# EAGLE schematic dsp_board_power_amplifier (EAGLE 9.6.2)
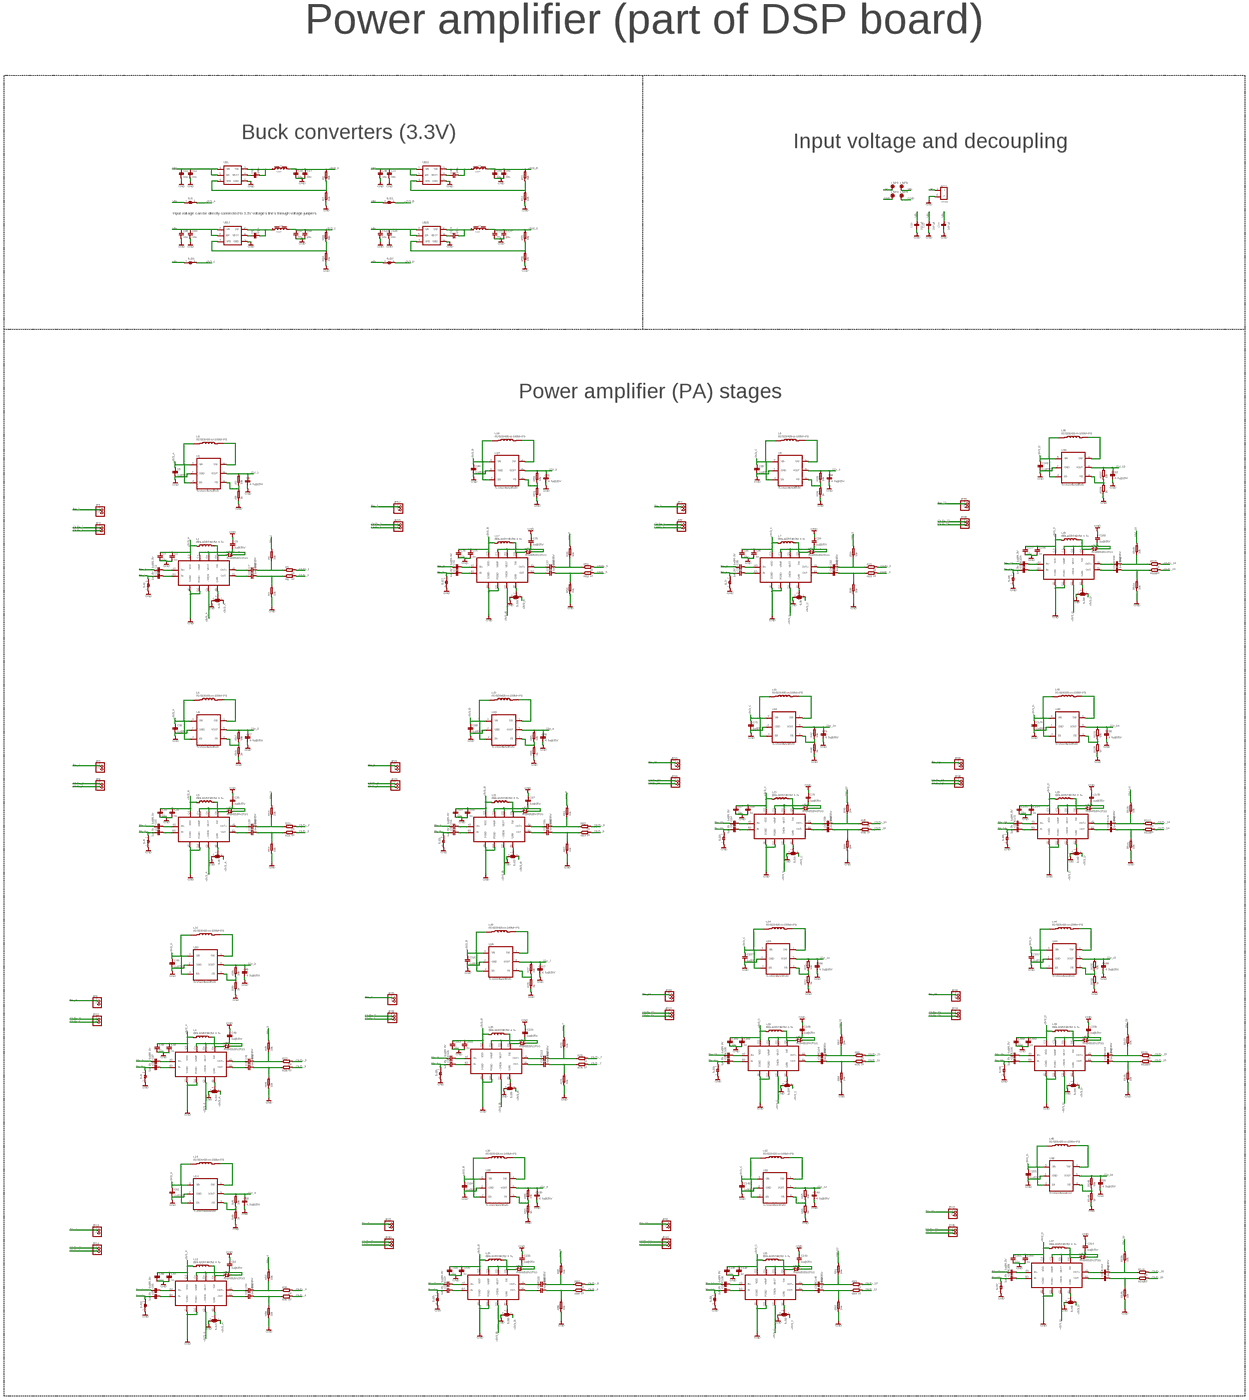
[diagram p0: schematic, sheet 1, overview]
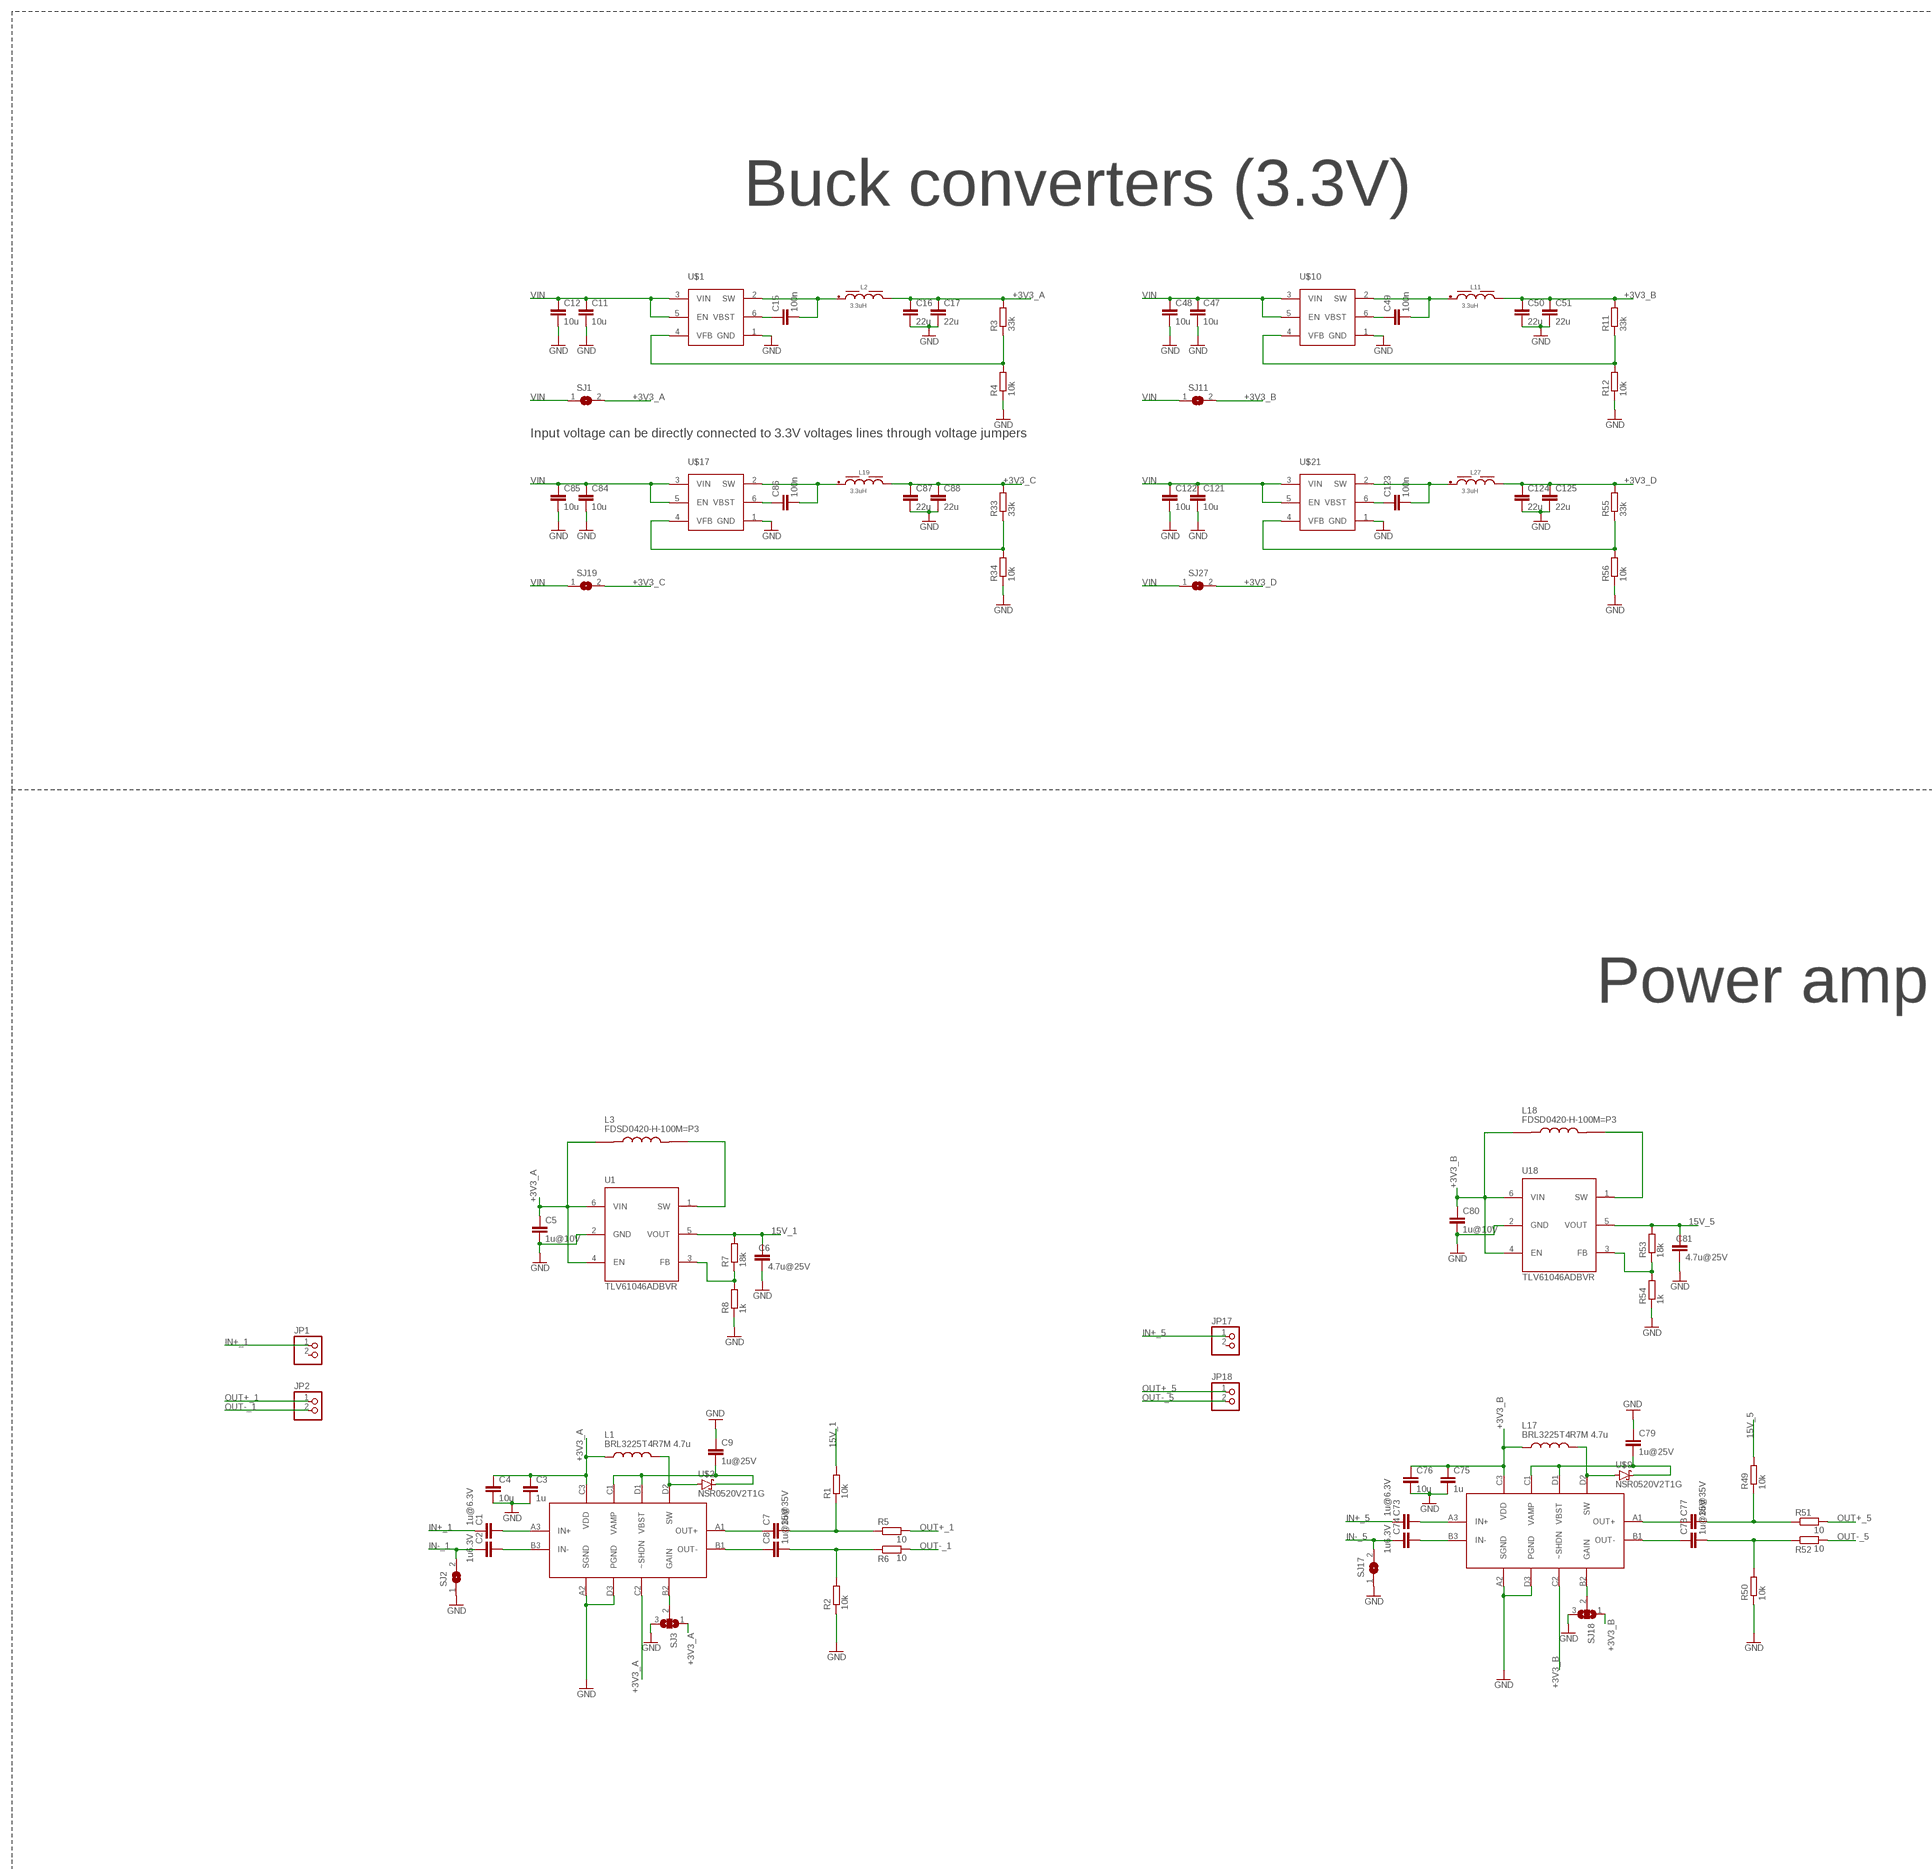
[diagram p1: schematic, sheet 1, part 1 of 6]
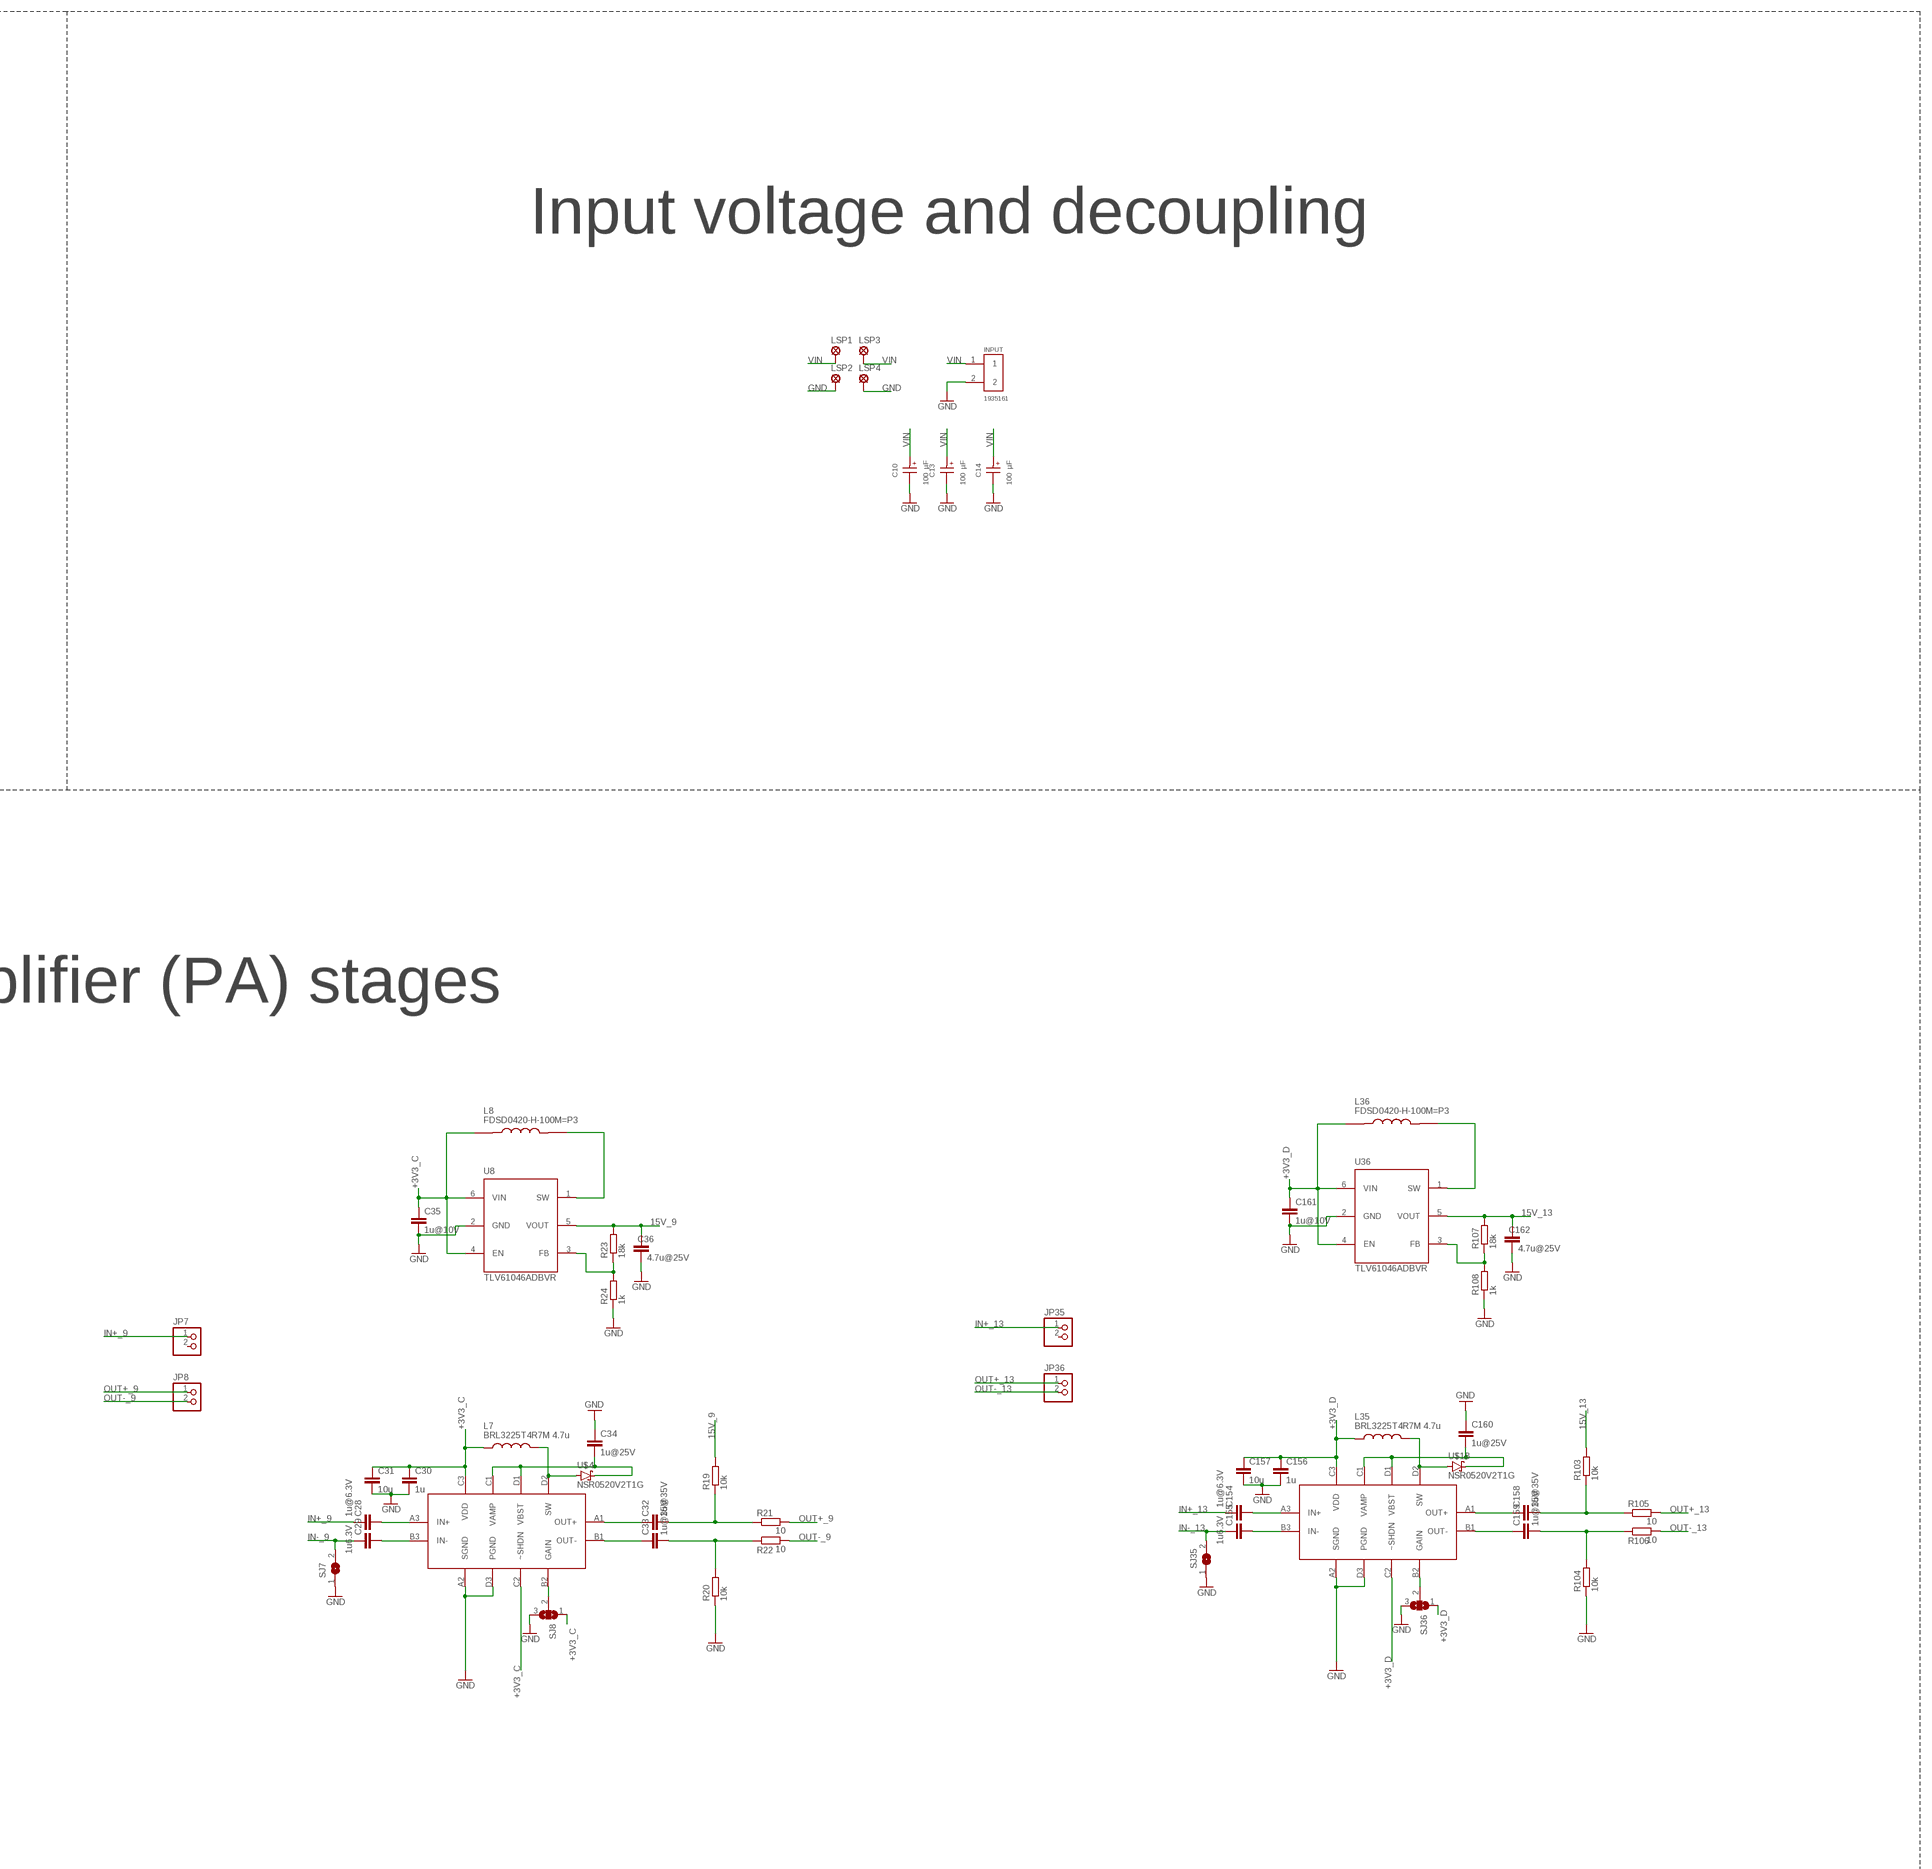
[diagram p2: schematic, sheet 1, part 2 of 6]
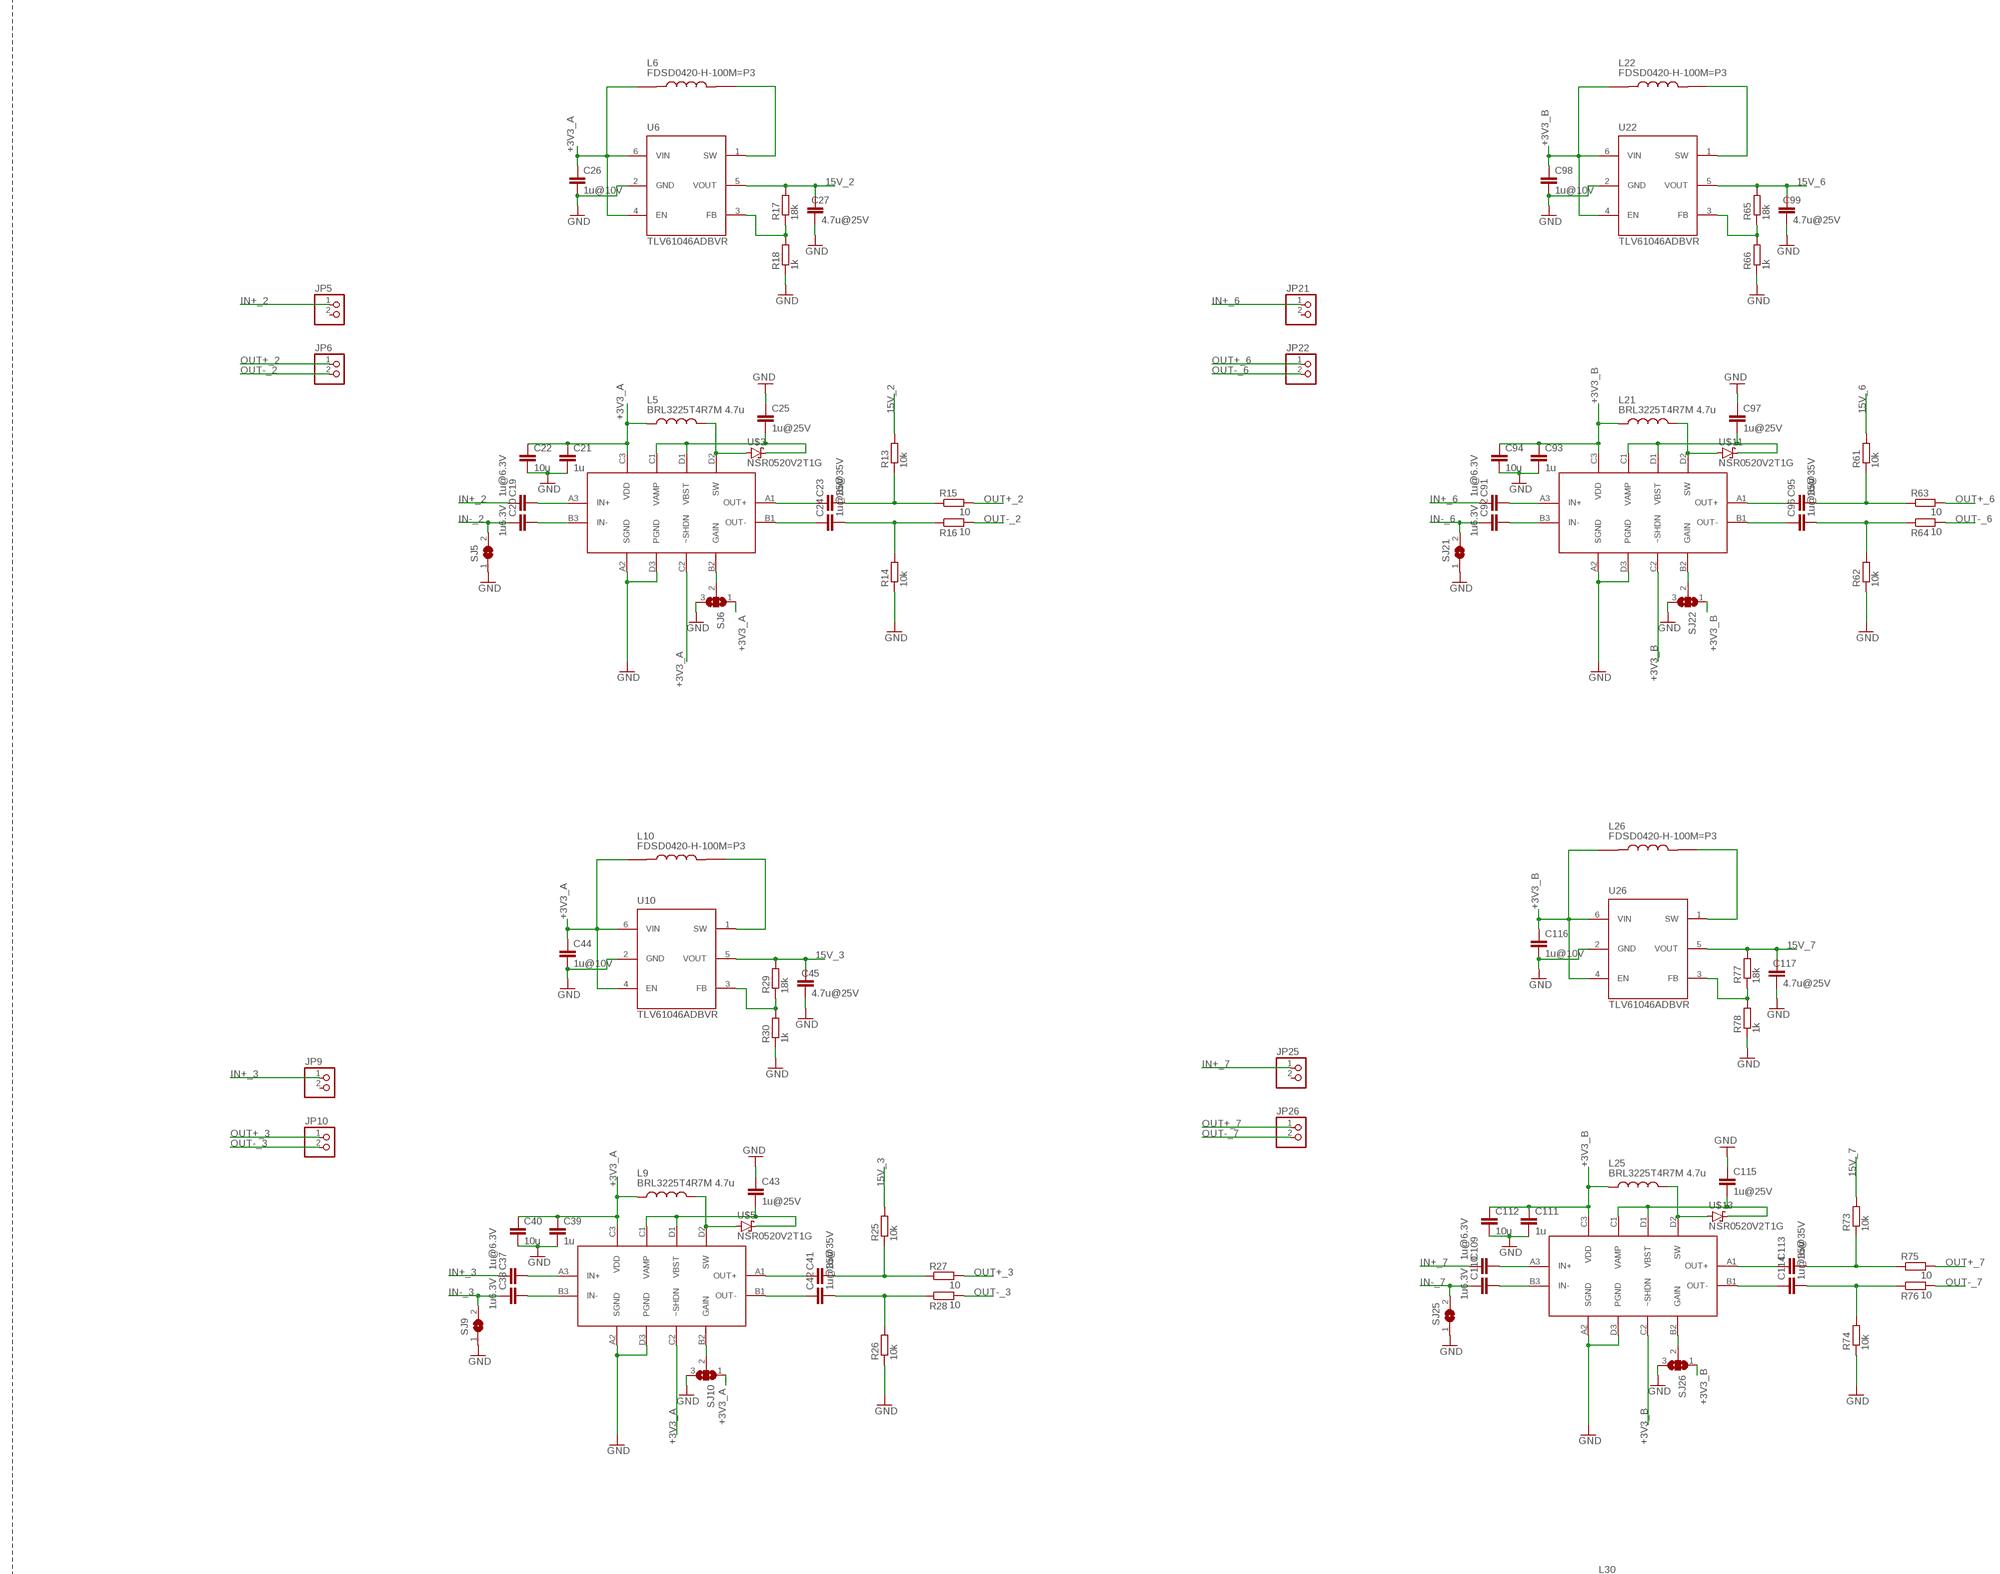
[diagram p3: schematic, sheet 1, part 3 of 6]
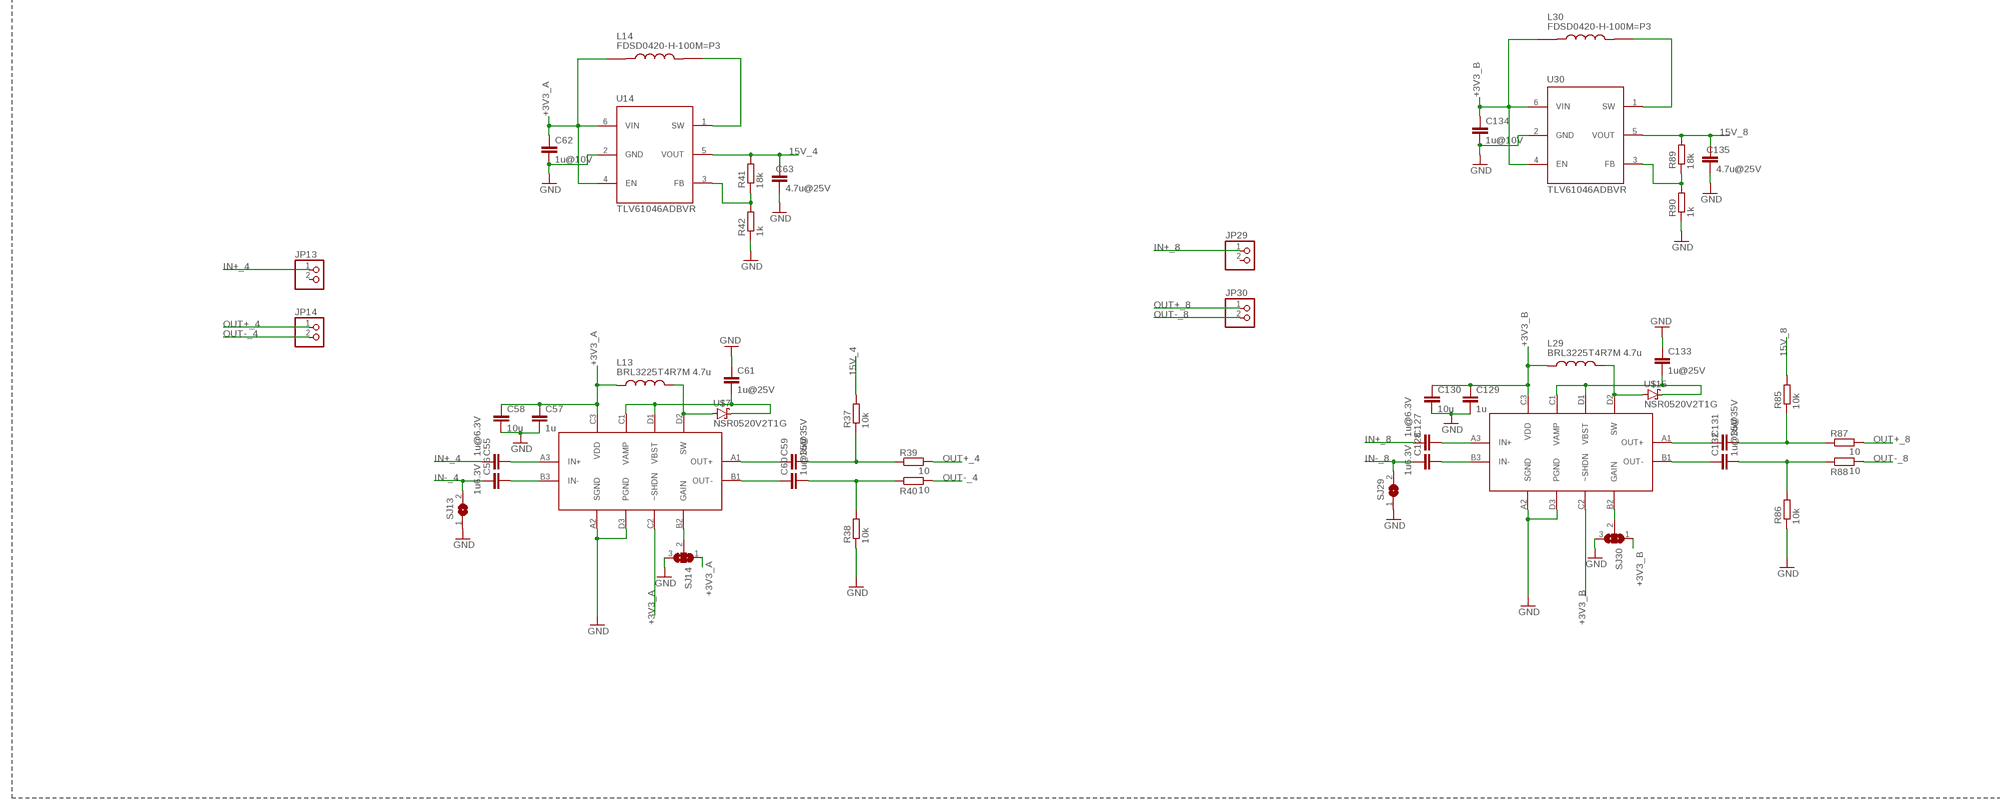
[diagram p4: schematic, sheet 1, part 4 of 6]
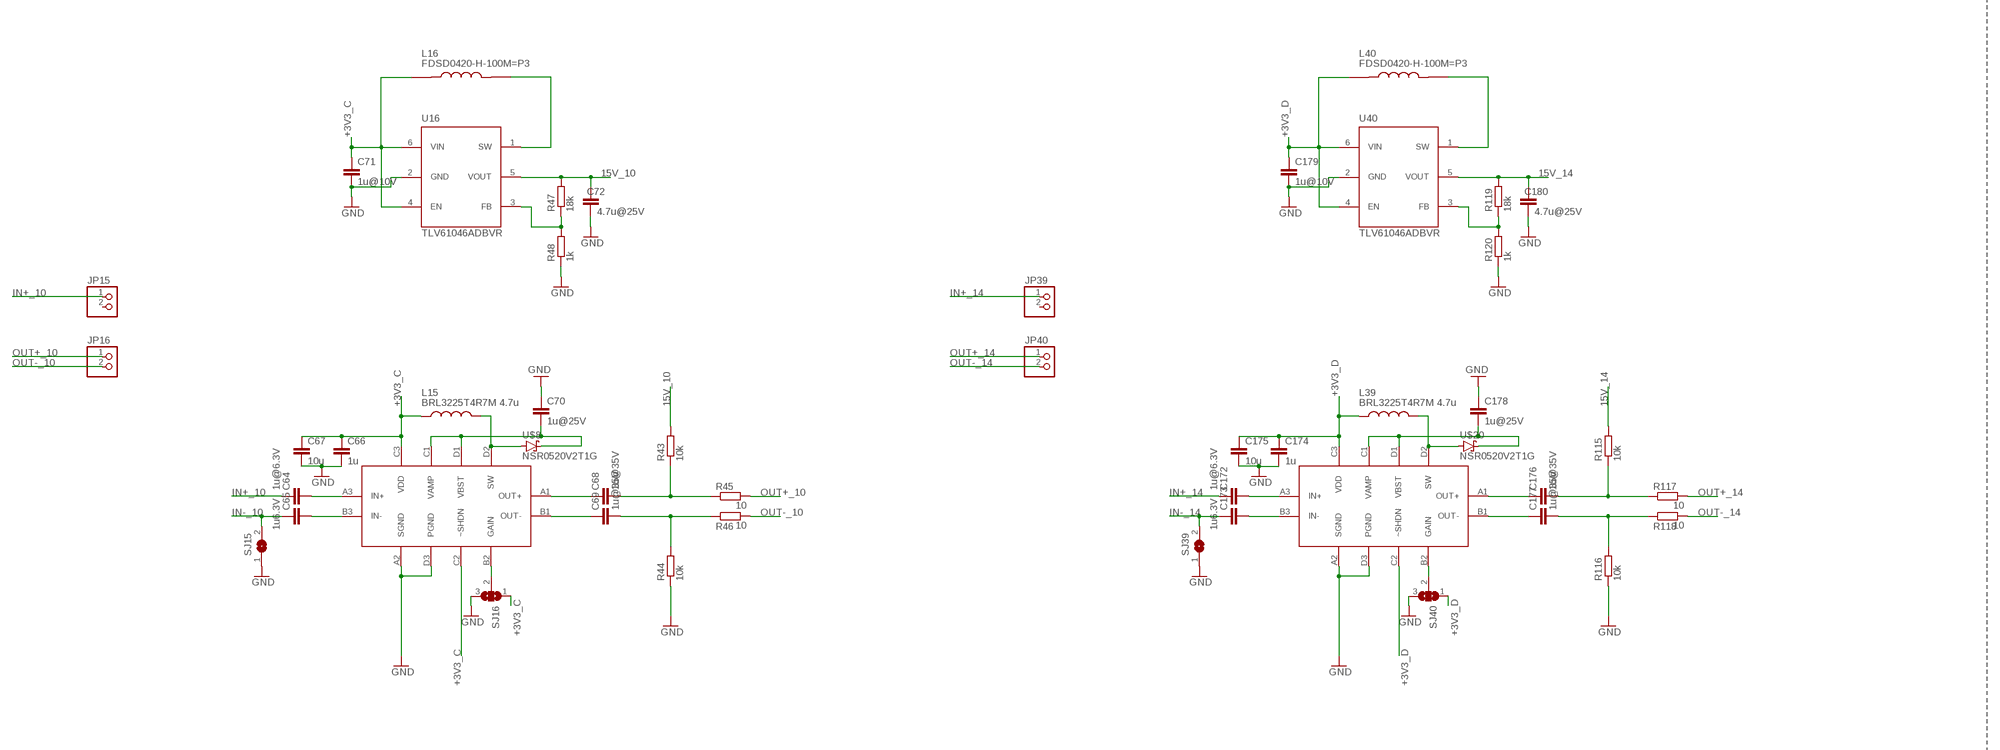
[diagram p5: schematic, sheet 1, part 5 of 6]
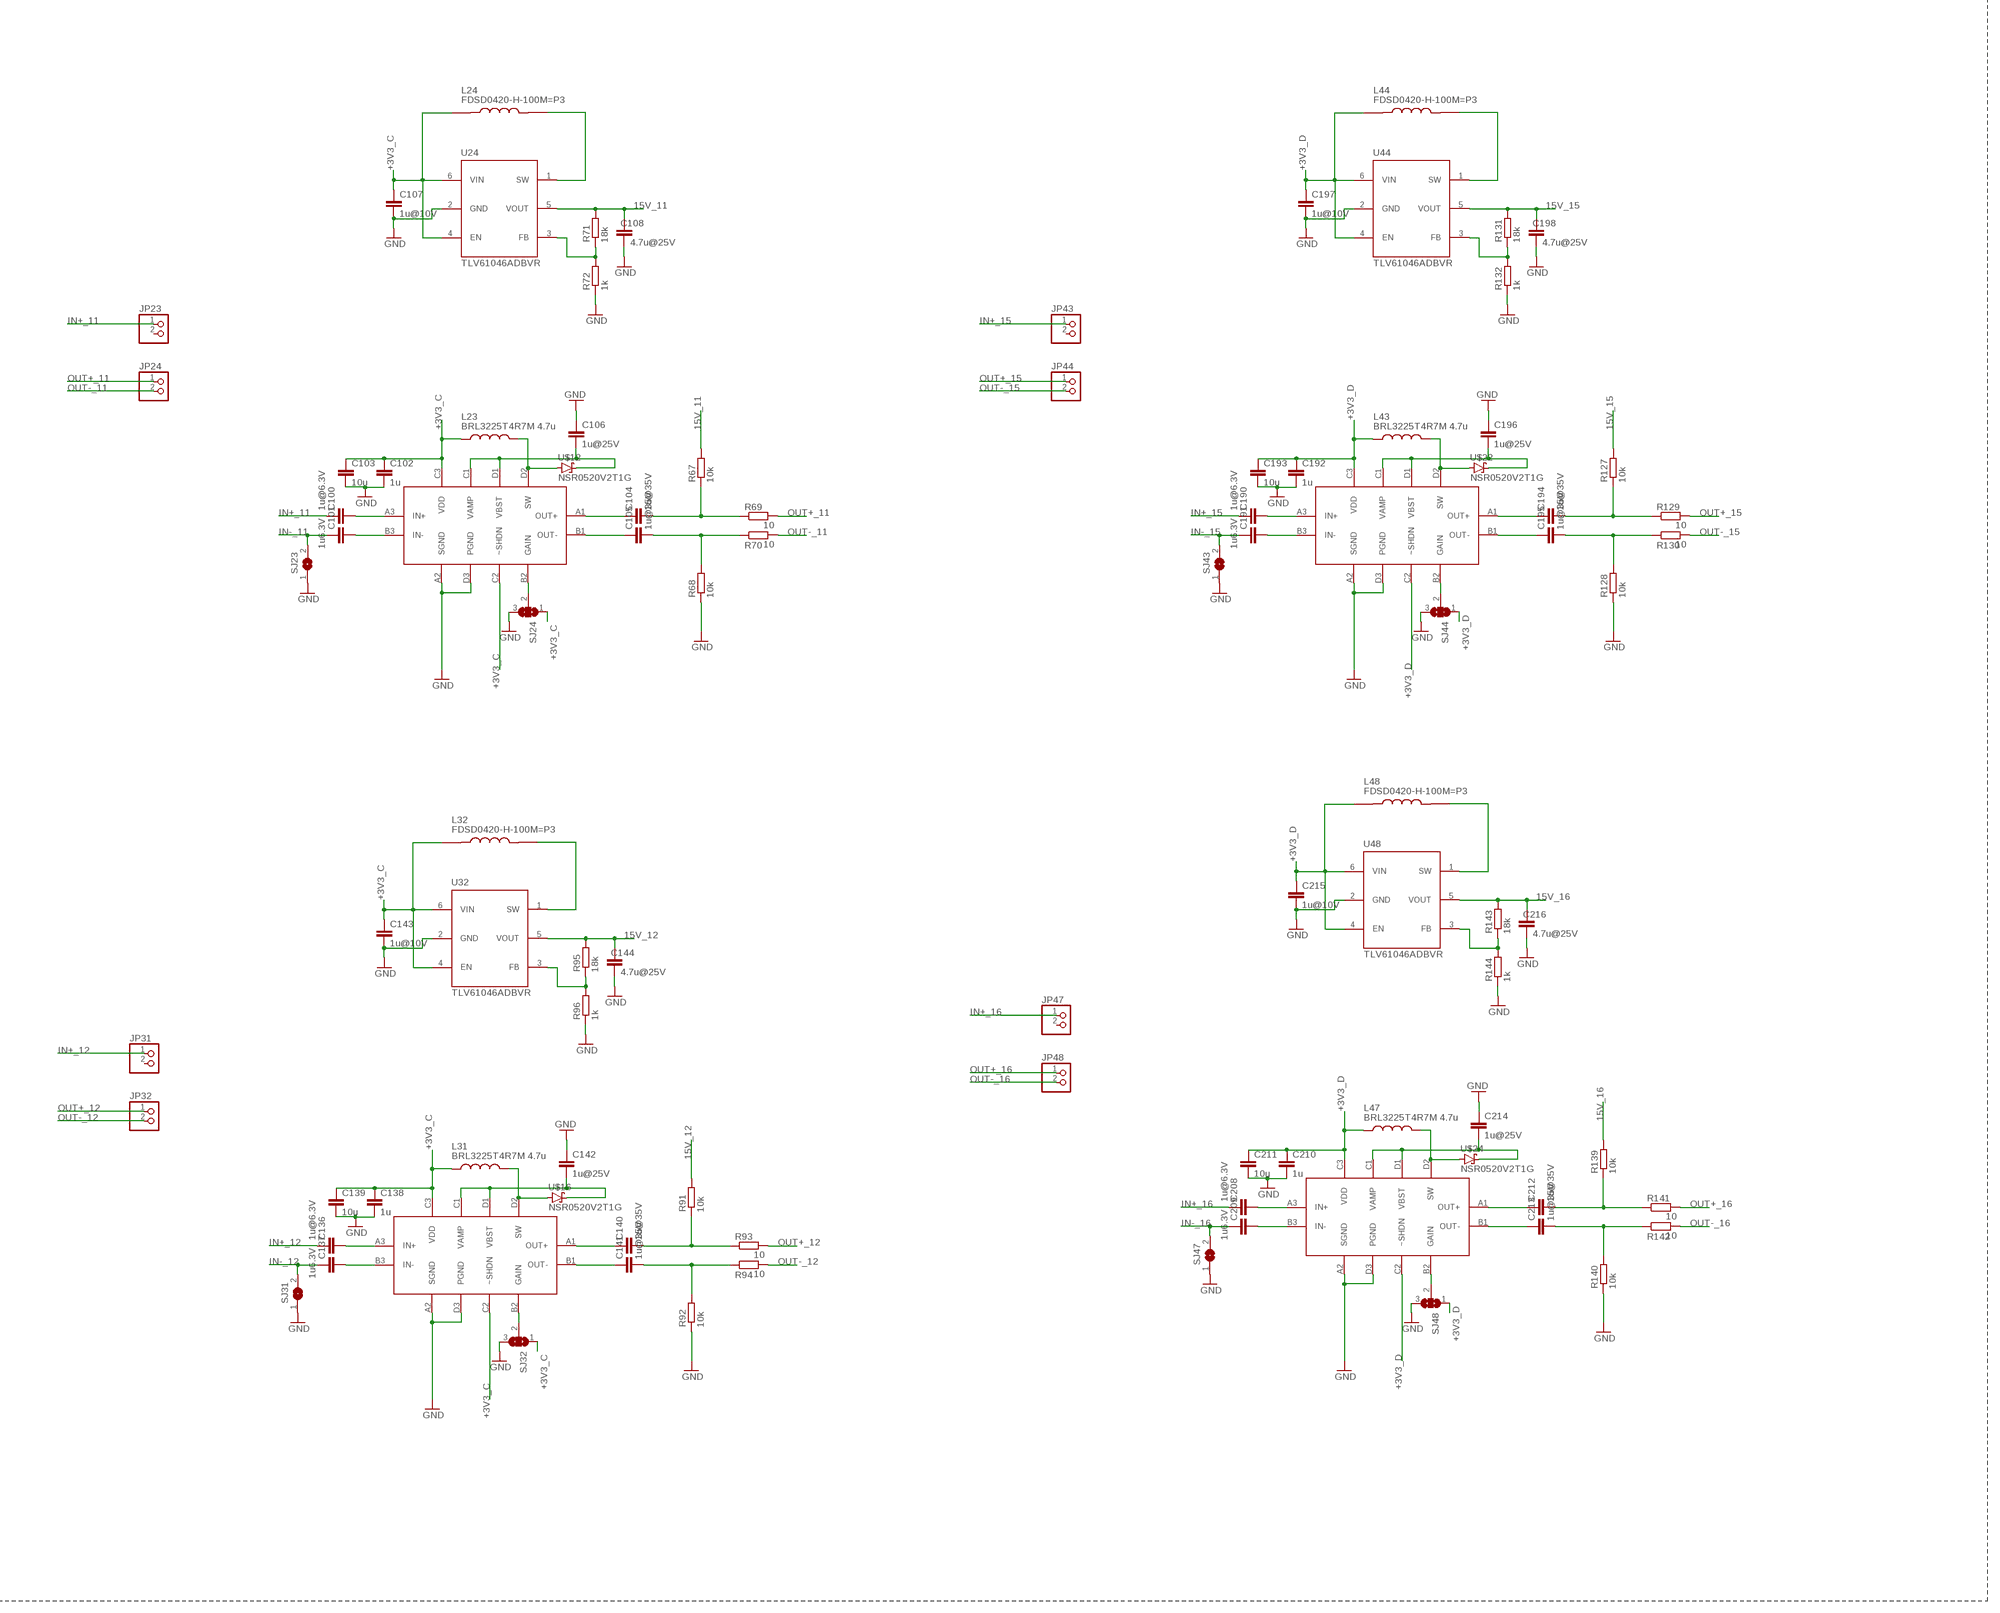
[diagram p6: schematic, sheet 1, part 6 of 6]

## Parts
C1  1u@6.3V  C-EUC0805  [C0805]
C2  1u6.3V  C-EUC0805  [C0805]
C3  1u  C-EUC0603  [C0603]
C4  10u  C-EUC0805  [C0805]
C5  1u@10V  C-EUC0603  [C0603]
C6  4.7u@25V  C-EUC0603  [C0603]
C7  1u@35V  C-EUC0603  [C0603]
C8  1u@35V  C-EUC0603  [C0603]
C9  1u@25V  C-EUC0603  [C0603]
C10  100 µF  WCAP-ASLU_6.3X7.7_865090445008  [WCAP-ASLU_6.3X7.7(DXL)]
C11  10u  C-EUC0805  [C0805]
C12  10u  C-EUC0805  [C0805]
C13  100 µF  WCAP-ASLU_6.3X7.7_865090445008  [WCAP-ASLU_6.3X7.7(DXL)]
C14  100 µF  WCAP-ASLU_6.3X7.7_865090445008  [WCAP-ASLU_6.3X7.7(DXL)]
C15  100n  C-EUC0603  [C0603]
C16  22u  C-EUC1206  [C1206]
C17  22u  C-EUC1206  [C1206]
C19  1u@6.3V  C-EUC0805  [C0805]
C20  1u6.3V  C-EUC0805  [C0805]
C21  1u  C-EUC0603  [C0603]
C22  10u  C-EUC0805  [C0805]
C23  1u@35V  C-EUC0603  [C0603]
C24  1u@35V  C-EUC0603  [C0603]
C25  1u@25V  C-EUC0603  [C0603]
C26  1u@10V  C-EUC0603  [C0603]
C27  4.7u@25V  C-EUC0603  [C0603]
C28  1u@6.3V  C-EUC0805  [C0805]
C29  1u6.3V  C-EUC0805  [C0805]
C30  1u  C-EUC0603  [C0603]
C31  10u  C-EUC0805  [C0805]
C32  1u@35V  C-EUC0603  [C0603]
C33  1u@35V  C-EUC0603  [C0603]
C34  1u@25V  C-EUC0603  [C0603]
C35  1u@10V  C-EUC0603  [C0603]
C36  4.7u@25V  C-EUC0603  [C0603]
C37  1u@6.3V  C-EUC0805  [C0805]
C38  1u6.3V  C-EUC0805  [C0805]
C39  1u  C-EUC0603  [C0603]
C40  10u  C-EUC0805  [C0805]
C41  1u@35V  C-EUC0603  [C0603]
C42  1u@35V  C-EUC0603  [C0603]
C43  1u@25V  C-EUC0603  [C0603]
C44  1u@10V  C-EUC0603  [C0603]
C45  4.7u@25V  C-EUC0603  [C0603]
C47  10u  C-EUC0805  [C0805]
C48  10u  C-EUC0805  [C0805]
C49  100n  C-EUC0603  [C0603]
C50  22u  C-EUC1206  [C1206]
C51  22u  C-EUC1206  [C1206]
C55  1u@6.3V  C-EUC0805  [C0805]
C56  1u6.3V  C-EUC0805  [C0805]
C57  1u  C-EUC0603  [C0603]
C58  10u  C-EUC0805  [C0805]
C59  1u@35V  C-EUC0603  [C0603]
C60  1u@35V  C-EUC0603  [C0603]
C61  1u@25V  C-EUC0603  [C0603]
C62  1u@10V  C-EUC0603  [C0603]
C63  4.7u@25V  C-EUC0603  [C0603]
C64  1u@6.3V  C-EUC0805  [C0805]
C65  1u6.3V  C-EUC0805  [C0805]
C66  1u  C-EUC0603  [C0603]
C67  10u  C-EUC0805  [C0805]
C68  1u@35V  C-EUC0603  [C0603]
C69  1u@35V  C-EUC0603  [C0603]
C70  1u@25V  C-EUC0603  [C0603]
C71  1u@10V  C-EUC0603  [C0603]
C72  4.7u@25V  C-EUC0603  [C0603]
C73  1u@6.3V  C-EUC0805  [C0805]
C74  1u6.3V  C-EUC0805  [C0805]
C75  1u  C-EUC0603  [C0603]
C76  10u  C-EUC0805  [C0805]
C77  1u@35V  C-EUC0603  [C0603]
C78  1u@35V  C-EUC0603  [C0603]
C79  1u@25V  C-EUC0603  [C0603]
C80  1u@10V  C-EUC0603  [C0603]
C81  4.7u@25V  C-EUC0603  [C0603]
C84  10u  C-EUC0805  [C0805]
C85  10u  C-EUC0805  [C0805]
C86  100n  C-EUC0603  [C0603]
C87  22u  C-EUC1206  [C1206]
C88  22u  C-EUC1206  [C1206]
C91  1u@6.3V  C-EUC0805  [C0805]
C92  1u6.3V  C-EUC0805  [C0805]
C93  1u  C-EUC0603  [C0603]
C94  10u  C-EUC0805  [C0805]
C95  1u@35V  C-EUC0603  [C0603]
C96  1u@35V  C-EUC0603  [C0603]
C97  1u@25V  C-EUC0603  [C0603]
C98  1u@10V  C-EUC0603  [C0603]
C99  4.7u@25V  C-EUC0603  [C0603]
C100  1u@6.3V  C-EUC0805  [C0805]
C101  1u6.3V  C-EUC0805  [C0805]
C102  1u  C-EUC0603  [C0603]
C103  10u  C-EUC0805  [C0805]
C104  1u@35V  C-EUC0603  [C0603]
C105  1u@35V  C-EUC0603  [C0603]
C106  1u@25V  C-EUC0603  [C0603]
C107  1u@10V  C-EUC0603  [C0603]
C108  4.7u@25V  C-EUC0603  [C0603]
C109  1u@6.3V  C-EUC0805  [C0805]
C110  1u6.3V  C-EUC0805  [C0805]
C111  1u  C-EUC0603  [C0603]
C112  10u  C-EUC0805  [C0805]
C113  1u@35V  C-EUC0603  [C0603]
C114  1u@35V  C-EUC0603  [C0603]
C115  1u@25V  C-EUC0603  [C0603]
C116  1u@10V  C-EUC0603  [C0603]
C117  4.7u@25V  C-EUC0603  [C0603]
C121  10u  C-EUC0805  [C0805]
C122  10u  C-EUC0805  [C0805]
C123  100n  C-EUC0603  [C0603]
C124  22u  C-EUC1206  [C1206]
C125  22u  C-EUC1206  [C1206]
C127  1u@6.3V  C-EUC0805  [C0805]
C128  1u6.3V  C-EUC0805  [C0805]
C129  1u  C-EUC0603  [C0603]
C130  10u  C-EUC0805  [C0805]
C131  1u@35V  C-EUC0603  [C0603]
C132  1u@35V  C-EUC0603  [C0603]
C133  1u@25V  C-EUC0603  [C0603]
C134  1u@10V  C-EUC0603  [C0603]
C135  4.7u@25V  C-EUC0603  [C0603]
C136  1u@6.3V  C-EUC0805  [C0805]
C137  1u6.3V  C-EUC0805  [C0805]
C138  1u  C-EUC0603  [C0603]
C139  10u  C-EUC0805  [C0805]
C140  1u@35V  C-EUC0603  [C0603]
C141  1u@35V  C-EUC0603  [C0603]
C142  1u@25V  C-EUC0603  [C0603]
C143  1u@10V  C-EUC0603  [C0603]
C144  4.7u@25V  C-EUC0603  [C0603]
C154  1u@6.3V  C-EUC0805  [C0805]
C155  1u6.3V  C-EUC0805  [C0805]
C156  1u  C-EUC0603  [C0603]
C157  10u  C-EUC0805  [C0805]
C158  1u@35V  C-EUC0603  [C0603]
C159  1u@35V  C-EUC0603  [C0603]
C160  1u@25V  C-EUC0603  [C0603]
C161  1u@10V  C-EUC0603  [C0603]
C162  4.7u@25V  C-EUC0603  [C0603]
C172  1u@6.3V  C-EUC0805  [C0805]
C173  1u6.3V  C-EUC0805  [C0805]
C174  1u  C-EUC0603  [C0603]
C175  10u  C-EUC0805  [C0805]
C176  1u@35V  C-EUC0603  [C0603]
C177  1u@35V  C-EUC0603  [C0603]
C178  1u@25V  C-EUC0603  [C0603]
C179  1u@10V  C-EUC0603  [C0603]
C180  4.7u@25V  C-EUC0603  [C0603]
C190  1u@6.3V  C-EUC0805  [C0805]
C191  1u6.3V  C-EUC0805  [C0805]
C192  1u  C-EUC0603  [C0603]
C193  10u  C-EUC0805  [C0805]
C194  1u@35V  C-EUC0603  [C0603]
C195  1u@35V  C-EUC0603  [C0603]
C196  1u@25V  C-EUC0603  [C0603]
C197  1u@10V  C-EUC0603  [C0603]
C198  4.7u@25V  C-EUC0603  [C0603]
C208  1u@6.3V  C-EUC0805  [C0805]
C209  1u6.3V  C-EUC0805  [C0805]
C210  1u  C-EUC0603  [C0603]
C211  10u  C-EUC0805  [C0805]
C212  1u@35V  C-EUC0603  [C0603]
C213  1u@35V  C-EUC0603  [C0603]
C214  1u@25V  C-EUC0603  [C0603]
C215  1u@10V  C-EUC0603  [C0603]
C216  4.7u@25V  C-EUC0603  [C0603]
INPUT  1935161  [PHOENIX_1935161]
JP1  PINHD-1X2  [1X02]
JP2  PINHD-1X2  [1X02]
JP5  PINHD-1X2  [1X02]
JP6  PINHD-1X2  [1X02]
JP7  PINHD-1X2  [1X02]
JP8  PINHD-1X2  [1X02]
JP9  PINHD-1X2  [1X02]
JP10  PINHD-1X2  [1X02]
JP13  PINHD-1X2  [1X02]
JP14  PINHD-1X2  [1X02]
JP15  PINHD-1X2  [1X02]
JP16  PINHD-1X2  [1X02]
JP17  PINHD-1X2  [1X02]
JP18  PINHD-1X2  [1X02]
JP21  PINHD-1X2  [1X02]
JP22  PINHD-1X2  [1X02]
JP23  PINHD-1X2  [1X02]
JP24  PINHD-1X2  [1X02]
JP25  PINHD-1X2  [1X02]
JP26  PINHD-1X2  [1X02]
JP29  PINHD-1X2  [1X02]
JP30  PINHD-1X2  [1X02]
JP31  PINHD-1X2  [1X02]
JP32  PINHD-1X2  [1X02]
JP35  PINHD-1X2  [1X02]
JP36  PINHD-1X2  [1X02]
JP39  PINHD-1X2  [1X02]
JP40  PINHD-1X2  [1X02]
JP43  PINHD-1X2  [1X02]
JP44  PINHD-1X2  [1X02]
JP47  PINHD-1X2  [1X02]
JP48  PINHD-1X2  [1X02]
L1  BRL3225T4R7M 4.7u  BRL3225T4R7M  [INDC3225X170N]
L2  3.3uH  WE-PD_7345P_7447773033  [WE-PD_7345P]
L3  FDSD0420-H-100M=P3  [IND_FDSD0420-H-100M=P3]
L5  BRL3225T4R7M 4.7u  BRL3225T4R7M  [INDC3225X170N]
L6  FDSD0420-H-100M=P3  [IND_FDSD0420-H-100M=P3]
L7  BRL3225T4R7M 4.7u  BRL3225T4R7M  [INDC3225X170N]
L8  FDSD0420-H-100M=P3  [IND_FDSD0420-H-100M=P3]
L9  BRL3225T4R7M 4.7u  BRL3225T4R7M  [INDC3225X170N]
L10  FDSD0420-H-100M=P3  [IND_FDSD0420-H-100M=P3]
L11  3.3uH  WE-PD_7345P_7447773033  [WE-PD_7345P]
L13  BRL3225T4R7M 4.7u  BRL3225T4R7M  [INDC3225X170N]
L14  FDSD0420-H-100M=P3  [IND_FDSD0420-H-100M=P3]
L15  BRL3225T4R7M 4.7u  BRL3225T4R7M  [INDC3225X170N]
L16  FDSD0420-H-100M=P3  [IND_FDSD0420-H-100M=P3]
L17  BRL3225T4R7M 4.7u  BRL3225T4R7M  [INDC3225X170N]
L18  FDSD0420-H-100M=P3  [IND_FDSD0420-H-100M=P3]
L19  3.3uH  WE-PD_7345P_7447773033  [WE-PD_7345P]
L21  BRL3225T4R7M 4.7u  BRL3225T4R7M  [INDC3225X170N]
L22  FDSD0420-H-100M=P3  [IND_FDSD0420-H-100M=P3]
L23  BRL3225T4R7M 4.7u  BRL3225T4R7M  [INDC3225X170N]
L24  FDSD0420-H-100M=P3  [IND_FDSD0420-H-100M=P3]
L25  BRL3225T4R7M 4.7u  BRL3225T4R7M  [INDC3225X170N]
L26  FDSD0420-H-100M=P3  [IND_FDSD0420-H-100M=P3]
L27  3.3uH  WE-PD_7345P_7447773033  [WE-PD_7345P]
L29  BRL3225T4R7M 4.7u  BRL3225T4R7M  [INDC3225X170N]
L30  FDSD0420-H-100M=P3  [IND_FDSD0420-H-100M=P3]
L31  BRL3225T4R7M 4.7u  BRL3225T4R7M  [INDC3225X170N]
L32  FDSD0420-H-100M=P3  [IND_FDSD0420-H-100M=P3]
L35  BRL3225T4R7M 4.7u  BRL3225T4R7M  [INDC3225X170N]
L36  FDSD0420-H-100M=P3  [IND_FDSD0420-H-100M=P3]
L39  BRL3225T4R7M 4.7u  BRL3225T4R7M  [INDC3225X170N]
L40  FDSD0420-H-100M=P3  [IND_FDSD0420-H-100M=P3]
L43  BRL3225T4R7M 4.7u  BRL3225T4R7M  [INDC3225X170N]
L44  FDSD0420-H-100M=P3  [IND_FDSD0420-H-100M=P3]
L47  BRL3225T4R7M 4.7u  BRL3225T4R7M  [INDC3225X170N]
L48  FDSD0420-H-100M=P3  [IND_FDSD0420-H-100M=P3]
LSP1  LSP10  [LSP10]
LSP2  LSP10  [LSP10]
LSP3  LSP10  [LSP10]
LSP4  LSP10  [LSP10]
R1  10k  R-EU_R0603  [R0603]
R2  10k  R-EU_R0603  [R0603]
R3  33k  R-EU_R0603  [R0603]
R4  10k  R-EU_R0603  [R0603]
R5  10  R-EU_R0603  [R0603]
R6  10  R-EU_R0603  [R0603]
R7  18k  R-EU_R0603  [R0603]
R8  1k  R-EU_R0603  [R0603]
R11  33k  R-EU_R0603  [R0603]
R12  10k  R-EU_R0603  [R0603]
R13  10k  R-EU_R0603  [R0603]
R14  10k  R-EU_R0603  [R0603]
R15  10  R-EU_R0603  [R0603]
R16  10  R-EU_R0603  [R0603]
R17  18k  R-EU_R0603  [R0603]
R18  1k  R-EU_R0603  [R0603]
R19  10k  R-EU_R0603  [R0603]
R20  10k  R-EU_R0603  [R0603]
R21  10  R-EU_R0603  [R0603]
R22  10  R-EU_R0603  [R0603]
R23  18k  R-EU_R0603  [R0603]
R24  1k  R-EU_R0603  [R0603]
R25  10k  R-EU_R0603  [R0603]
R26  10k  R-EU_R0603  [R0603]
R27  10  R-EU_R0603  [R0603]
R28  10  R-EU_R0603  [R0603]
R29  18k  R-EU_R0603  [R0603]
R30  1k  R-EU_R0603  [R0603]
R33  33k  R-EU_R0603  [R0603]
R34  10k  R-EU_R0603  [R0603]
R37  10k  R-EU_R0603  [R0603]
R38  10k  R-EU_R0603  [R0603]
R39  10  R-EU_R0603  [R0603]
R40  10  R-EU_R0603  [R0603]
R41  18k  R-EU_R0603  [R0603]
R42  1k  R-EU_R0603  [R0603]
R43  10k  R-EU_R0603  [R0603]
R44  10k  R-EU_R0603  [R0603]
R45  10  R-EU_R0603  [R0603]
R46  10  R-EU_R0603  [R0603]
R47  18k  R-EU_R0603  [R0603]
R48  1k  R-EU_R0603  [R0603]
R49  10k  R-EU_R0603  [R0603]
R50  10k  R-EU_R0603  [R0603]
R51  10  R-EU_R0603  [R0603]
R52  10  R-EU_R0603  [R0603]
R53  18k  R-EU_R0603  [R0603]
R54  1k  R-EU_R0603  [R0603]
R55  33k  R-EU_R0603  [R0603]
R56  10k  R-EU_R0603  [R0603]
R61  10k  R-EU_R0603  [R0603]
R62  10k  R-EU_R0603  [R0603]
R63  10  R-EU_R0603  [R0603]
R64  10  R-EU_R0603  [R0603]
R65  18k  R-EU_R0603  [R0603]
R66  1k  R-EU_R0603  [R0603]
R67  10k  R-EU_R0603  [R0603]
R68  10k  R-EU_R0603  [R0603]
R69  10  R-EU_R0603  [R0603]
R70  10  R-EU_R0603  [R0603]
R71  18k  R-EU_R0603  [R0603]
R72  1k  R-EU_R0603  [R0603]
R73  10k  R-EU_R0603  [R0603]
R74  10k  R-EU_R0603  [R0603]
R75  10  R-EU_R0603  [R0603]
R76  10  R-EU_R0603  [R0603]
R77  18k  R-EU_R0603  [R0603]
R78  1k  R-EU_R0603  [R0603]
R85  10k  R-EU_R0603  [R0603]
R86  10k  R-EU_R0603  [R0603]
R87  10  R-EU_R0603  [R0603]
R88  10  R-EU_R0603  [R0603]
R89  18k  R-EU_R0603  [R0603]
R90  1k  R-EU_R0603  [R0603]
R91  10k  R-EU_R0603  [R0603]
R92  10k  R-EU_R0603  [R0603]
R93  10  R-EU_R0603  [R0603]
R94  10  R-EU_R0603  [R0603]
R95  18k  R-EU_R0603  [R0603]
R96  1k  R-EU_R0603  [R0603]
R103  10k  R-EU_R0603  [R0603]
R104  10k  R-EU_R0603  [R0603]
R105  10  R-EU_R0603  [R0603]
R106  10  R-EU_R0603  [R0603]
R107  18k  R-EU_R0603  [R0603]
R108  1k  R-EU_R0603  [R0603]
R115  10k  R-EU_R0603  [R0603]
R116  10k  R-EU_R0603  [R0603]
R117  10  R-EU_R0603  [R0603]
R118  10  R-EU_R0603  [R0603]
R119  18k  R-EU_R0603  [R0603]
R120  1k  R-EU_R0603  [R0603]
R127  10k  R-EU_R0603  [R0603]
R128  10k  R-EU_R0603  [R0603]
R129  10  R-EU_R0603  [R0603]
R130  10  R-EU_R0603  [R0603]
R131  18k  R-EU_R0603  [R0603]
R132  1k  R-EU_R0603  [R0603]
R139  10k  R-EU_R0603  [R0603]
R140  10k  R-EU_R0603  [R0603]
R141  10  R-EU_R0603  [R0603]
R142  10  R-EU_R0603  [R0603]
R143  18k  R-EU_R0603  [R0603]
R144  1k  R-EU_R0603  [R0603]
SJ1  SJ  [SJ]
SJ2  SJ  [SJ]
SJ3  SJ2W  [SJ_2]
SJ5  SJ  [SJ]
SJ6  SJ2W  [SJ_2]
SJ7  SJ  [SJ]
SJ8  SJ2W  [SJ_2]
SJ9  SJ  [SJ]
SJ10  SJ2W  [SJ_2]
SJ11  SJ  [SJ]
SJ13  SJ  [SJ]
SJ14  SJ2W  [SJ_2]
SJ15  SJ  [SJ]
SJ16  SJ2W  [SJ_2]
SJ17  SJ  [SJ]
SJ18  SJ2W  [SJ_2]
SJ19  SJ  [SJ]
SJ21  SJ  [SJ]
SJ22  SJ2W  [SJ_2]
SJ23  SJ  [SJ]
SJ24  SJ2W  [SJ_2]
SJ25  SJ  [SJ]
SJ26  SJ2W  [SJ_2]
SJ27  SJ  [SJ]
SJ29  SJ  [SJ]
SJ30  SJ2W  [SJ_2]
SJ31  SJ  [SJ]
SJ32  SJ2W  [SJ_2]
SJ35  SJ  [SJ]
SJ36  SJ2W  [SJ_2]
SJ39  SJ  [SJ]
SJ40  SJ2W  [SJ_2]
SJ43  SJ  [SJ]
SJ44  SJ2W  [SJ_2]
SJ47  SJ  [SJ]
SJ48  SJ2W  [SJ_2]
U1  TLV61046ADBVR  [SOT95P280X145-6N]
U2  LM48580  [BGA12N40P3X4_119X159X62N]
U5  LM48580  [BGA12N40P3X4_119X159X62N]
U6  TLV61046ADBVR  [SOT95P280X145-6N]
U7  LM48580  [BGA12N40P3X4_119X159X62N]
U8  TLV61046ADBVR  [SOT95P280X145-6N]
U9  LM48580  [BGA12N40P3X4_119X159X62N]
U10  TLV61046ADBVR  [SOT95P280X145-6N]
U13  LM48580  [BGA12N40P3X4_119X159X62N]
U14  TLV61046ADBVR  [SOT95P280X145-6N]
U15  LM48580  [BGA12N40P3X4_119X159X62N]
U16  TLV61046ADBVR  [SOT95P280X145-6N]
U17  LM48580  [BGA12N40P3X4_119X159X62N]
U18  TLV61046ADBVR  [SOT95P280X145-6N]
U21  LM48580  [BGA12N40P3X4_119X159X62N]
U22  TLV61046ADBVR  [SOT95P280X145-6N]
U23  LM48580  [BGA12N40P3X4_119X159X62N]
U24  TLV61046ADBVR  [SOT95P280X145-6N]
U25  LM48580  [BGA12N40P3X4_119X159X62N]
U26  TLV61046ADBVR  [SOT95P280X145-6N]
U29  LM48580  [BGA12N40P3X4_119X159X62N]
U30  TLV61046ADBVR  [SOT95P280X145-6N]
U31  LM48580  [BGA12N40P3X4_119X159X62N]
U32  TLV61046ADBVR  [SOT95P280X145-6N]
U35  LM48580  [BGA12N40P3X4_119X159X62N]
U36  TLV61046ADBVR  [SOT95P280X145-6N]
U39  LM48580  [BGA12N40P3X4_119X159X62N]
U40  TLV61046ADBVR  [SOT95P280X145-6N]
U43  LM48580  [BGA12N40P3X4_119X159X62N]
U44  TLV61046ADBVR  [SOT95P280X145-6N]
U47  LM48580  [BGA12N40P3X4_119X159X62N]
U48  TLV61046ADBVR  [SOT95P280X145-6N]
U$1  TPS562209  [SOT95P280X110-6N]
U$2  NSR0520V2T1G  [SOD523]
U$3  NSR0520V2T1G  [SOD523]
U$4  NSR0520V2T1G  [SOD523]
U$5  NSR0520V2T1G  [SOD523]
U$7  NSR0520V2T1G  [SOD523]
U$8  NSR0520V2T1G  [SOD523]
U$9  NSR0520V2T1G  [SOD523]
U$10  TPS562209  [SOT95P280X110-6N]
U$11  NSR0520V2T1G  [SOD523]
U$12  NSR0520V2T1G  [SOD523]
U$13  NSR0520V2T1G  [SOD523]
U$15  NSR0520V2T1G  [SOD523]
U$16  NSR0520V2T1G  [SOD523]
U$17  TPS562209  [SOT95P280X110-6N]
U$18  NSR0520V2T1G  [SOD523]
U$20  NSR0520V2T1G  [SOD523]
U$21  TPS562209  [SOT95P280X110-6N]
U$22  NSR0520V2T1G  [SOD523]
U$24  NSR0520V2T1G  [SOD523]

## Nets
15V_1: C6.1 R1.2 R7.2 U1.5(VOUT)
15V_2: C27.1 R13.2 R17.2 U6.5(VOUT)
15V_3: C45.1 R25.2 R29.2 U10.5(VOUT)
15V_4: C63.1 R37.2 R41.2 U14.5(VOUT)
15V_5: C81.1 R49.2 R53.2 U18.5(VOUT)
15V_6: C99.1 R61.2 R65.2 U22.5(VOUT)
15V_7: C117.1 R73.2 R77.2 U26.5(VOUT)
15V_8: C135.1 R85.2 R89.2 U30.5(VOUT)
15V_9: C36.1 R19.2 R23.2 U8.5(VOUT)
15V_10: C72.1 R43.2 R47.2 U16.5(VOUT)
15V_11: C108.1 R67.2 R71.2 U24.5(VOUT)
15V_12: C144.1 R91.2 R95.2 U32.5(VOUT)
15V_13: C162.1 R103.2 R107.2 U36.5(VOUT)
15V_14: C180.1 R115.2 R119.2 U40.5(VOUT)
15V_15: C198.1 R127.2 R131.2 U44.5(VOUT)
15V_16: C216.1 R139.2 R143.2 U48.5(VOUT)
+3V3_A: C3.1 C4.1 C5.1 C16.1 C17.1 C21.1 C22.1 C26.1 C39.1 C40.1 C44.1 C57.1 C58.1 C62.1 L1.1 L2.2 L3.1 L5.1 L6.1 L9.1 L10.1 L13.1 L14.1 R3.2 SJ1.2 SJ3.1 SJ6.1 SJ10.1 SJ14.1 U1.4(EN) U1.6(VIN) U2.C2(~SHDN) U2.C3(VDD) U5.C2(~SHDN) U5.C3(VDD) U6.4(EN) U6.6(VIN) U9.C2(~SHDN) U9.C3(VDD) U10.4(EN) U10.6(VIN) U13.C2(~SHDN) U13.C3(VDD) U14.4(EN) U14.6(VIN)
+3V3_B: C50.1 C51.1 C75.1 C76.1 C80.1 C93.1 C94.1 C98.1 C111.1 C112.1 C116.1 C129.1 C130.1 C134.1 L11.2 L17.1 L18.1 L21.1 L22.1 L25.1 L26.1 L29.1 L30.1 R11.2 SJ11.2 SJ18.1 SJ22.1 SJ26.1 SJ30.1 U17.C2(~SHDN) U17.C3(VDD) U18.4(EN) U18.6(VIN) U21.C2(~SHDN) U21.C3(VDD) U22.4(EN) U22.6(VIN) U25.C2(~SHDN) U25.C3(VDD) U26.4(EN) U26.6(VIN) U29.C2(~SHDN) U29.C3(VDD) U30.4(EN) U30.6(VIN)
+3V3_C: C30.1 C31.1 C35.1 C66.1 C67.1 C71.1 C87.1 C88.1 C102.1 C103.1 C107.1 C138.1 C139.1 C143.1 L7.1 L8.1 L15.1 L16.1 L19.2 L23.1 L24.1 L31.1 L32.1 R33.2 SJ8.1 SJ16.1 SJ19.2 SJ24.1 SJ32.1 U7.C2(~SHDN) U7.C3(VDD) U8.4(EN) U8.6(VIN) U15.C2(~SHDN) U15.C3(VDD) U16.4(EN) U16.6(VIN) U23.C2(~SHDN) U23.C3(VDD) U24.4(EN) U24.6(VIN) U31.C2(~SHDN) U31.C3(VDD) U32.4(EN) U32.6(VIN)
+3V3_D: C124.1 C125.1 C156.1 C157.1 C161.1 C174.1 C175.1 C179.1 C192.1 C193.1 C197.1 C210.1 C211.1 C215.1 L27.2 L35.1 L36.1 L39.1 L40.1 L43.1 L44.1 L47.1 L48.1 R55.2 SJ27.2 SJ36.1 SJ40.1 SJ44.1 SJ48.1 U35.C2(~SHDN) U35.C3(VDD) U36.4(EN) U36.6(VIN) U39.C2(~SHDN) U39.C3(VDD) U40.4(EN) U40.6(VIN) U43.C2(~SHDN) U43.C3(VDD) U44.4(EN) U44.6(VIN) U47.C2(~SHDN) U47.C3(VDD) U48.4(EN) U48.6(VIN)
GND: C3.2 C4.2 C5.2 C6.2 C9.1 C10.2(-) C11.2 C12.2 C13.2(-) C14.2(-) C16.2 C17.2 C21.2 C22.2 C25.1 C26.2 C27.2 C30.2 C31.2 C34.1 C35.2 C36.2 C39.2 C40.2 C43.1 C44.2 C45.2 C47.2 C48.2 C50.2 C51.2 C57.2 C58.2 C61.1 C62.2 C63.2 C66.2 C67.2 C70.1 C71.2 C72.2 C75.2 C76.2 C79.1 C80.2 C81.2 C84.2 C85.2 C87.2 C88.2 C93.2 C94.2 C97.1 C98.2 C99.2 C102.2 C103.2 C106.1 C107.2 C108.2 C111.2 C112.2 C115.1 C116.2 C117.2 C121.2 C122.2 C124.2 C125.2 C129.2 C130.2 C133.1 C134.2 C135.2 C138.2 C139.2 C142.1 C143.2 C144.2 C156.2 C157.2 C160.1 C161.2 C162.2 C174.2 C175.2 C178.1 C179.2 C180.2 C192.2 C193.2 C196.1 C197.2 C198.2 C210.2 C211.2 C214.1 C215.2 C216.2 INPUT.2 LSP2.MP LSP4.MP R2.1 R4.1 R8.1 R12.1 R14.1 R18.1 R20.1 R24.1 R26.1 R30.1 R34.1 R38.1 R42.1 R44.1 R48.1 R50.1 R54.1 R56.1 R62.1 R66.1 R68.1 R72.1 R74.1 R78.1 R86.1 R90.1 R92.1 R96.1 R104.1 R108.1 R116.1 R120.1 R128.1 R132.1 R140.1 R144.1 SJ2.1 SJ3.3 SJ5.1 SJ6.3 SJ7.1 SJ8.3 SJ9.1 SJ10.3 SJ13.1 SJ14.3 SJ15.1 SJ16.3 SJ17.1 SJ18.3 SJ21.1 SJ22.3 SJ23.1 SJ24.3 SJ25.1 SJ26.3 SJ29.1 SJ30.3 SJ31.1 SJ32.3 SJ35.1 SJ36.3 SJ39.1 SJ40.3 SJ43.1 SJ44.3 SJ47.1 SJ48.3 U1.2(GND) U2.A2(SGND) U2.D3(PGND) U5.A2(SGND) U5.D3(PGND) U6.2(GND) U7.A2(SGND) U7.D3(PGND) U8.2(GND) U9.A2(SGND) U9.D3(PGND) U10.2(GND) U13.A2(SGND) U13.D3(PGND) U14.2(GND) U15.A2(SGND) U15.D3(PGND) U16.2(GND) U17.A2(SGND) U17.D3(PGND) U18.2(GND) U21.A2(SGND) U21.D3(PGND) U22.2(GND) U23.A2(SGND) U23.D3(PGND) U24.2(GND) U25.A2(SGND) U25.D3(PGND) U26.2(GND) U29.A2(SGND) U29.D3(PGND) U30.2(GND) U31.A2(SGND) U31.D3(PGND) U32.2(GND) U35.A2(SGND) U35.D3(PGND) U36.2(GND) U39.A2(SGND) U39.D3(PGND) U40.2(GND) U43.A2(SGND) U43.D3(PGND) U44.2(GND) U47.A2(SGND) U47.D3(PGND) U48.2(GND) U$1.1(GND) U$10.1(GND) U$17.1(GND) U$21.1(GND)
IN+_1: C1.1 JP1.1
IN+_2: C19.1 JP5.1
IN+_3: C37.1 JP9.1
IN+_4: C55.1 JP13.1
IN+_5: C73.1 JP17.1
IN+_6: C91.1 JP21.1
IN+_7: C109.1 JP25.1
IN+_8: C127.1 JP29.1
IN+_9: C28.1 JP7.1
IN+_10: C64.1 JP15.1
IN+_11: C100.1 JP23.1
IN+_12: C136.1 JP31.1
IN+_13: C154.1 JP35.1
IN+_14: C172.1 JP39.1
IN+_15: C190.1 JP43.1
IN+_16: C208.1 JP47.1
IN-_1: C2.1 SJ2.2
IN-_2: C20.1 SJ5.2
IN-_3: C38.1 SJ9.2
IN-_4: C56.1 SJ13.2
IN-_5: C74.1 SJ17.2
IN-_6: C92.1 SJ21.2
IN-_7: C110.1 SJ25.2
IN-_8: C128.1 SJ29.2
IN-_9: C29.1 SJ7.2
IN-_10: C65.1 SJ15.2
IN-_11: C101.1 SJ23.2
IN-_12: C137.1 SJ31.2
IN-_13: C155.1 SJ35.2
IN-_14: C173.1 SJ39.2
IN-_15: C191.1 SJ43.2
IN-_16: C209.1 SJ47.2
N$1: C1.2 U2.A3(IN+)
N$2: C2.2 U2.B3(IN-)
N$3: SJ3.2 U2.B2(GAIN)
N$4: C7.1 U2.A1(OUT+)
N$5: C8.1 U2.B1(OUT-)
N$6: C7.2 R1.1 R5.1
N$7: L1.2 U2.D2(SW) U$2.2(A)
N$8: C9.2 U2.C1(VAMP) U2.D1(VBST) U$2.1(C)
N$9: C8.2 R2.2 R6.1
N$10: R3.1 R4.2 U$1.4(VFB)
N$11: L3.2 U1.1(SW)
N$12: R7.1 R8.2 U1.3(FB)
N$13: C15.1 U$1.6(VBST)
N$14: C15.2 L2.1 U$1.2(SW)
N$18: R11.1 R12.2 U$10.4(VFB)
N$19: C49.1 U$10.6(VBST)
N$20: C49.2 L11.1 U$10.2(SW)
N$23: C19.2 U5.A3(IN+)
N$24: C20.2 U5.B3(IN-)
N$25: SJ6.2 U5.B2(GAIN)
N$26: C23.1 U5.A1(OUT+)
N$27: C24.1 U5.B1(OUT-)
N$28: C23.2 R13.1 R15.1
N$29: C24.2 R14.2 R16.1
N$30: L6.2 U6.1(SW)
N$31: R17.1 R18.2 U6.3(FB)
N$32: L5.2 U5.D2(SW) U$3.2(A)
N$33: C25.2 U5.C1(VAMP) U5.D1(VBST) U$3.1(C)
N$34: C28.2 U7.A3(IN+)
N$35: C29.2 U7.B3(IN-)
N$36: SJ8.2 U7.B2(GAIN)
N$37: C32.1 U7.A1(OUT+)
N$38: C33.1 U7.B1(OUT-)
N$39: C32.2 R19.1 R21.1
N$40: C33.2 R20.2 R22.1
N$41: L8.2 U8.1(SW)
N$42: R23.1 R24.2 U8.3(FB)
N$43: L7.2 U7.D2(SW) U$4.2(A)
N$44: C34.2 U7.C1(VAMP) U7.D1(VBST) U$4.1(C)
N$45: C37.2 U9.A3(IN+)
N$46: C38.2 U9.B3(IN-)
N$47: SJ10.2 U9.B2(GAIN)
N$48: C41.1 U9.A1(OUT+)
N$49: C42.1 U9.B1(OUT-)
N$50: C41.2 R25.1 R27.1
N$51: C42.2 R26.2 R28.1
N$52: L10.2 U10.1(SW)
N$53: R29.1 R30.2 U10.3(FB)
N$54: L9.2 U9.D2(SW) U$5.2(A)
N$55: C43.2 U9.C1(VAMP) U9.D1(VBST) U$5.1(C)
N$57: R33.1 R34.2 U$17.4(VFB)
N$58: C86.1 U$17.6(VBST)
N$59: C86.2 L19.1 U$17.2(SW)
N$63: R55.1 R56.2 U$21.4(VFB)
N$64: C123.1 U$21.6(VBST)
N$65: C123.2 L27.1 U$21.2(SW)
N$67: C55.2 U13.A3(IN+)
N$68: C56.2 U13.B3(IN-)
N$69: SJ14.2 U13.B2(GAIN)
N$70: C59.1 U13.A1(OUT+)
N$71: C60.1 U13.B1(OUT-)
N$72: C59.2 R37.1 R39.1
N$73: C60.2 R38.2 R40.1
N$74: L14.2 U14.1(SW)
N$75: R41.1 R42.2 U14.3(FB)
N$76: L13.2 U13.D2(SW) U$7.2(A)
N$77: C61.2 U13.C1(VAMP) U13.D1(VBST) U$7.1(C)
N$78: C64.2 U15.A3(IN+)
N$79: C65.2 U15.B3(IN-)
N$80: SJ16.2 U15.B2(GAIN)
N$81: C68.1 U15.A1(OUT+)
N$82: C69.1 U15.B1(OUT-)
N$83: C68.2 R43.1 R45.1
N$84: C69.2 R44.2 R46.1
N$85: L16.2 U16.1(SW)
N$86: R47.1 R48.2 U16.3(FB)
N$87: L15.2 U15.D2(SW) U$8.2(A)
N$88: C70.2 U15.C1(VAMP) U15.D1(VBST) U$8.1(C)
N$89: C73.2 U17.A3(IN+)
N$90: C74.2 U17.B3(IN-)
N$91: SJ18.2 U17.B2(GAIN)
N$92: C77.1 U17.A1(OUT+)
N$93: C78.1 U17.B1(OUT-)
N$94: C77.2 R49.1 R51.1
N$95: C78.2 R50.2 R52.1
N$96: L18.2 U18.1(SW)
N$97: R53.1 R54.2 U18.3(FB)
N$98: L17.2 U17.D2(SW) U$9.2(A)
N$99: C79.2 U17.C1(VAMP) U17.D1(VBST) U$9.1(C)
N$111: C91.2 U21.A3(IN+)
N$112: C92.2 U21.B3(IN-)
N$113: SJ22.2 U21.B2(GAIN)
N$114: C95.1 U21.A1(OUT+)
N$115: C96.1 U21.B1(OUT-)
N$116: C95.2 R61.1 R63.1
N$117: C96.2 R62.2 R64.1
N$118: L22.2 U22.1(SW)
N$119: R65.1 R66.2 U22.3(FB)
N$120: L21.2 U21.D2(SW) U$11.2(A)
N$121: C97.2 U21.C1(VAMP) U21.D1(VBST) U$11.1(C)
N$122: C100.2 U23.A3(IN+)
N$123: C101.2 U23.B3(IN-)
N$124: SJ24.2 U23.B2(GAIN)
N$125: C104.1 U23.A1(OUT+)
N$126: C105.1 U23.B1(OUT-)
N$127: C104.2 R67.1 R69.1
N$128: C105.2 R68.2 R70.1
N$129: L24.2 U24.1(SW)
N$130: R71.1 R72.2 U24.3(FB)
N$131: L23.2 U23.D2(SW) U$12.2(A)
N$132: C106.2 U23.C1(VAMP) U23.D1(VBST) U$12.1(C)
N$133: C109.2 U25.A3(IN+)
N$134: C110.2 U25.B3(IN-)
N$135: SJ26.2 U25.B2(GAIN)
N$136: C113.1 U25.A1(OUT+)
N$137: C114.1 U25.B1(OUT-)
N$138: C113.2 R73.1 R75.1
N$139: C114.2 R74.2 R76.1
N$140: L26.2 U26.1(SW)
N$141: R77.1 R78.2 U26.3(FB)
N$142: L25.2 U25.D2(SW) U$13.2(A)
N$143: C115.2 U25.C1(VAMP) U25.D1(VBST) U$13.1(C)
N$155: C127.2 U29.A3(IN+)
N$156: C128.2 U29.B3(IN-)
N$157: SJ30.2 U29.B2(GAIN)
N$158: C131.1 U29.A1(OUT+)
N$159: C132.1 U29.B1(OUT-)
N$160: C131.2 R85.1 R87.1
N$161: C132.2 R86.2 R88.1
N$162: L30.2 U30.1(SW)
N$163: R89.1 R90.2 U30.3(FB)
N$164: L29.2 U29.D2(SW) U$15.2(A)
N$165: C133.2 U29.C1(VAMP) U29.D1(VBST) U$15.1(C)
N$166: C136.2 U31.A3(IN+)
N$167: C137.2 U31.B3(IN-)
N$168: SJ32.2 U31.B2(GAIN)
N$169: C140.1 U31.A1(OUT+)
N$170: C141.1 U31.B1(OUT-)
N$171: C140.2 R91.1 R93.1
N$172: C141.2 R92.2 R94.1
N$173: L32.2 U32.1(SW)
N$174: R95.1 R96.2 U32.3(FB)
N$175: L31.2 U31.D2(SW) U$16.2(A)
N$176: C142.2 U31.C1(VAMP) U31.D1(VBST) U$16.1(C)
N$188: C154.2 U35.A3(IN+)
N$189: C155.2 U35.B3(IN-)
N$190: SJ36.2 U35.B2(GAIN)
N$191: C158.1 U35.A1(OUT+)
N$192: C159.1 U35.B1(OUT-)
N$193: C158.2 R103.1 R105.1
N$194: C159.2 R104.2 R106.1
N$195: L36.2 U36.1(SW)
N$196: R107.1 R108.2 U36.3(FB)
N$197: L35.2 U35.D2(SW) U$18.2(A)
N$198: C160.2 U35.C1(VAMP) U35.D1(VBST) U$18.1(C)
N$210: C172.2 U39.A3(IN+)
N$211: C173.2 U39.B3(IN-)
N$212: SJ40.2 U39.B2(GAIN)
N$213: C176.1 U39.A1(OUT+)
N$214: C177.1 U39.B1(OUT-)
N$215: C176.2 R115.1 R117.1
N$216: C177.2 R116.2 R118.1
N$217: L40.2 U40.1(SW)
N$218: R119.1 R120.2 U40.3(FB)
N$219: L39.2 U39.D2(SW) U$20.2(A)
N$220: C178.2 U39.C1(VAMP) U39.D1(VBST) U$20.1(C)
N$232: C190.2 U43.A3(IN+)
N$233: C191.2 U43.B3(IN-)
N$234: SJ44.2 U43.B2(GAIN)
N$235: C194.1 U43.A1(OUT+)
N$236: C195.1 U43.B1(OUT-)
N$237: C194.2 R127.1 R129.1
N$238: C195.2 R128.2 R130.1
N$239: L44.2 U44.1(SW)
N$240: R131.1 R132.2 U44.3(FB)
N$241: L43.2 U43.D2(SW) U$22.2(A)
N$242: C196.2 U43.C1(VAMP) U43.D1(VBST) U$22.1(C)
N$254: C208.2 U47.A3(IN+)
N$255: C209.2 U47.B3(IN-)
N$256: SJ48.2 U47.B2(GAIN)
N$257: C212.1 U47.A1(OUT+)
N$258: C213.1 U47.B1(OUT-)
N$259: C212.2 R139.1 R141.1
N$260: C213.2 R140.2 R142.1
N$261: L48.2 U48.1(SW)
N$262: R143.1 R144.2 U48.3(FB)
N$263: L47.2 U47.D2(SW) U$24.2(A)
N$264: C214.2 U47.C1(VAMP) U47.D1(VBST) U$24.1(C)
OUT+_1: JP2.1 R5.2
OUT+_2: JP6.1 R15.2
OUT+_3: JP10.1 R27.2
OUT+_4: JP14.1 R39.2
OUT+_5: JP18.1 R51.2
OUT+_6: JP22.1 R63.2
OUT+_7: JP26.1 R75.2
OUT+_8: JP30.1 R87.2
OUT+_9: JP8.1 R21.2
OUT+_10: JP16.1 R45.2
OUT+_11: JP24.1 R69.2
OUT+_12: JP32.1 R93.2
OUT+_13: JP36.1 R105.2
OUT+_14: JP40.1 R117.2
OUT+_15: JP44.1 R129.2
OUT+_16: JP48.1 R141.2
OUT-_1: JP2.2 R6.2
OUT-_2: JP6.2 R16.2
OUT-_3: JP10.2 R28.2
OUT-_4: JP14.2 R40.2
OUT-_5: JP18.2 R52.2
OUT-_6: JP22.2 R64.2
OUT-_7: JP26.2 R76.2
OUT-_8: JP30.2 R88.2
OUT-_9: JP8.2 R22.2
OUT-_10: JP16.2 R46.2
OUT-_11: JP24.2 R70.2
OUT-_12: JP32.2 R94.2
OUT-_13: JP36.2 R106.2
OUT-_14: JP40.2 R118.2
OUT-_15: JP44.2 R130.2
OUT-_16: JP48.2 R142.2
VIN: C10.1(+) C11.1 C12.1 C13.1(+) C14.1(+) C47.1 C48.1 C84.1 C85.1 C121.1 C122.1 INPUT.1 LSP1.MP LSP3.MP SJ1.1 SJ11.1 SJ19.1 SJ27.1 U$1.3(VIN) U$1.5(EN) U$10.3(VIN) U$10.5(EN) U$17.3(VIN) U$17.5(EN) U$21.3(VIN) U$21.5(EN)
Unconnected: JP1.2 JP5.2 JP7.2 JP9.2 JP13.2 JP15.2 JP17.2 JP21.2 JP23.2 JP25.2 JP29.2 JP31.2 JP35.2 JP39.2 JP43.2 JP47.2

## Notes on the sheet
- Power amplifier (part of DSP board)
- Buck converters (3.3V)
- Input voltage and decoupling
- Input voltage can be directly connected to 3.3V voltages lines through voltage jumpers
- Power amplifier (PA) stages

## Library data of the parts
C1-C9 C11 C12 C15-C17 C19-C45 C47-C51 C55-C81 C84-C88 C91-C117 C121-C125 C127-C144 C154-C162 C172-C180 C190-C198 C208-C216 = rcl:C-EU: CAPACITOR, European symbol; SPICEPREFIX: C
C10 C13 C14 = 865090445008_Eagle_WCAP-ASLU_rev20a:WCAP-ASLU_6.3X7.7: WCAP-ASLU Aluminium Electrolytic Capacitors Low Leakage +85 °C Characteristics Low leakage current product series Mounting style: V-Chip SMT Capacitance range: 0.1 µF ‒ 330 µF Capacitance tolerance: ±20 % Voltage range (UR): 6.3 ‒ 63 V(DC) Operating temperature: -40 °C up to +85 °C Endurance: 1000 h @ +85 °C Dimensions (DxL) in mm: 3.0 x 5.5 up to 8.0 x 6.5 Recommended soldering: Reflow soldering Applications Durable battery applications and small handheld devices Input and output capacitor for switched-mode power supply Filtering Smoothing e.g. DC/DC converter, AC/DC converter, satellite receiver, control panel <https://www.we-online.com/catalog/media/o14725v209%20Family_WCAP-ASLU.jpg> Details see: https://www.we-online.com/catalog/en/WCAP-ASLU/ Updated by yingchun,Shan;2020-03-03 2020(C) Würth Elektronik; DATASHEET-URL: https://www.we-online.com/catalog/datasheet/865090445008.pdf; DF: 16%; DIAMETER: 6.3mm; I-LEAK: 5uA; I-RIPPLE: 102mA; L: 7.7mm; OPERATING-TEMPERATURE: -40 °C up to +85 °C; PART-NUMBER: 865090445008; TECHNICAL-REFERENCE: ASBD077101M025DVCTCA000; VR: 25V(DC); Z: 0.547075Ohm
INPUT = 1935161:1935161: Conn Terminal Blocks 2 POS 5mm Solder ST Thru-Hole 16A; AVAILABILITY: Unavailable; DESCRIPTION: 2 Position Wire to Board Terminal Block Horizontal with Board 0.197 _5.00mm_ Through Hole; MF: Phoenix Contact; MP: 1935161; PACKAGE: None; PRICE: None
JP1 JP2 JP5-JP10 JP13-JP18 JP21-JP26 JP29-JP32 JP35 JP36 JP39 JP40 JP43 JP44 JP47 JP48 = pinhead:PINHD-1X2: PIN HEADER
L1 L5 L7 L9 L13 L15 L17 L21 L23 L25 L29 L31 L35 L39 L43 L47 = BRL3225T4R7M:BRL3225T4R7M: WIREWOUND INDUCTOR 4.7UH 1.3A 20% 120MHZ; AVAILABILITY: Unavailable; DESCRIPTION: 4.7µH Unshielded Wirewound Inductor 1A 216mOhm Max 1210 _3225 Metric_; MF: Taiyo Yuden; MP: BRL3225T4R7M; PACKAGE: 3225 Taiyo Yuden; PRICE: None
L2 L11 L19 L27 = 7447773033_Eagle_WE-PD_rev19b:WE-PD_7345P: WE-PD SMT Power Inductor Characteristics AECQ 200 Qualified Ultra low RDC and RAC Highest possible saturation current based on Ferrite Suitable for switching frequency up to 10MHz Temperature dependent parameter available on Redexpert Operating Temperature from -40°C to +125°C / +150°C Types WE-PD: Since always with low loss material, tight tolerances and high saturation behavior compared to other manufacturers in the market WE-PD Robust: Plastic base improves the mechanical stability and efficiency WE-PD Performance: MnZn core improves Saturation and RDC for highest efficiency Applications Switch Mode Power supplies from 0,1W up to 300W Integrated DC DC Converter Ideal for Switch Mode Power supplies with extreme high efficiency (>95%) <https://katalog.we-online.com/media/images/v2/o14825v209%20Family_WE-PD.jpg> Details see: https://katalog.we-online.com/en/pbs/WE-PD Updated by Yingchun,Shan 2019-07-25 2019 (C) Wurth Elektronik; DATASHEET-URL: https://www.we-online.com/catalog/datasheet/7447773033.pdf; FRES: 51MHz; IR: 4.3A; ISAT: 6.6A; MOUNT: SMT; PART-NUMBER: 7447773033; RDC-MAX: 21mOhm; RDC-TYP: 15.5mOhm; VERSION: Performance
L3 L6 L8 L10 L14 L16 L18 L22 L24 L26 L30 L32 L36 L40 L44 L48 = FDSD0420-H-100M_P3:FDSD0420-H-100M=P3: 2.2µH Shielded Wirewound Inductor 3.6A 47mOhm Max Nonstandard; AVAILABILITY: Unavailable; DESCRIPTION: Inductor with Inductance: 10uH Tol. +/-20%, Package: 1515 _4040_; MF: Murata; MP: FDSD0420-H-100M=P3; PACKAGE: NONSTANDARD; PRICE: None
LSP1-LSP4 = solpad:LSP10: SOLDER PAD drill 1.0 mm, distributor Buerklin, 12H555
R1-R8 R11-R30 R33 R34 R37-R56 R61-R78 R85-R96 R103-R108 R115-R120 R127-R132 R139-R144 = rcl:R-EU_: RESISTOR, European symbol; SPICEPREFIX: R
SJ1 SJ2 SJ5 SJ7 SJ9 SJ11 SJ13 SJ15 SJ17 SJ19 SJ21 SJ23 SJ25 SJ27 SJ29 SJ31 SJ35 SJ39 SJ43 SJ47 = jumper:SJ: SMD solder JUMPER
SJ3 SJ6 SJ8 SJ10 SJ14 SJ16 SJ18 SJ22 SJ24 SJ26 SJ30 SJ32 SJ36 SJ40 SJ44 SJ48 = jumper:SJ2W: SMD solder JUMPER
U1 U6 U8 U10 U14 U16 U18 U22 U24 U26 U30 U32 U36 U40 U44 U48 = TLV61046ADBVR:TLV61046ADBVR: 28-V Output Voltage Boost Converter with Power Diode and Isolation Switch 6-SOT-23 -40 to 125; AVAILABILITY: Unavailable; DESCRIPTION: Boost Switching Regulator IC Positive Adjustable 3.3V 1 Output SOT-23-6; MF: Texas Instruments; MP: TLV61046ADBVR; PACKAGE: SOT-23 Texas Instruments; PRICE: None
U2 U5 U7 U9 U13 U15 U17 U21 U23 U25 U29 U31 U35 U39 U43 U47 = BGA12N40P3X4_119X159X62N:LM48580
U$1 U$10 U$17 U$21 = SOT95P280X110-6N:TPS562209
U$2-U$5 U$7-U$9 U$11-U$13 U$15 U$16 U$18 U$20 U$22 U$24 = SOD523:NSR0520V2T1G